# EAGLE design robotic_arm (EAGLE 8.4.1)
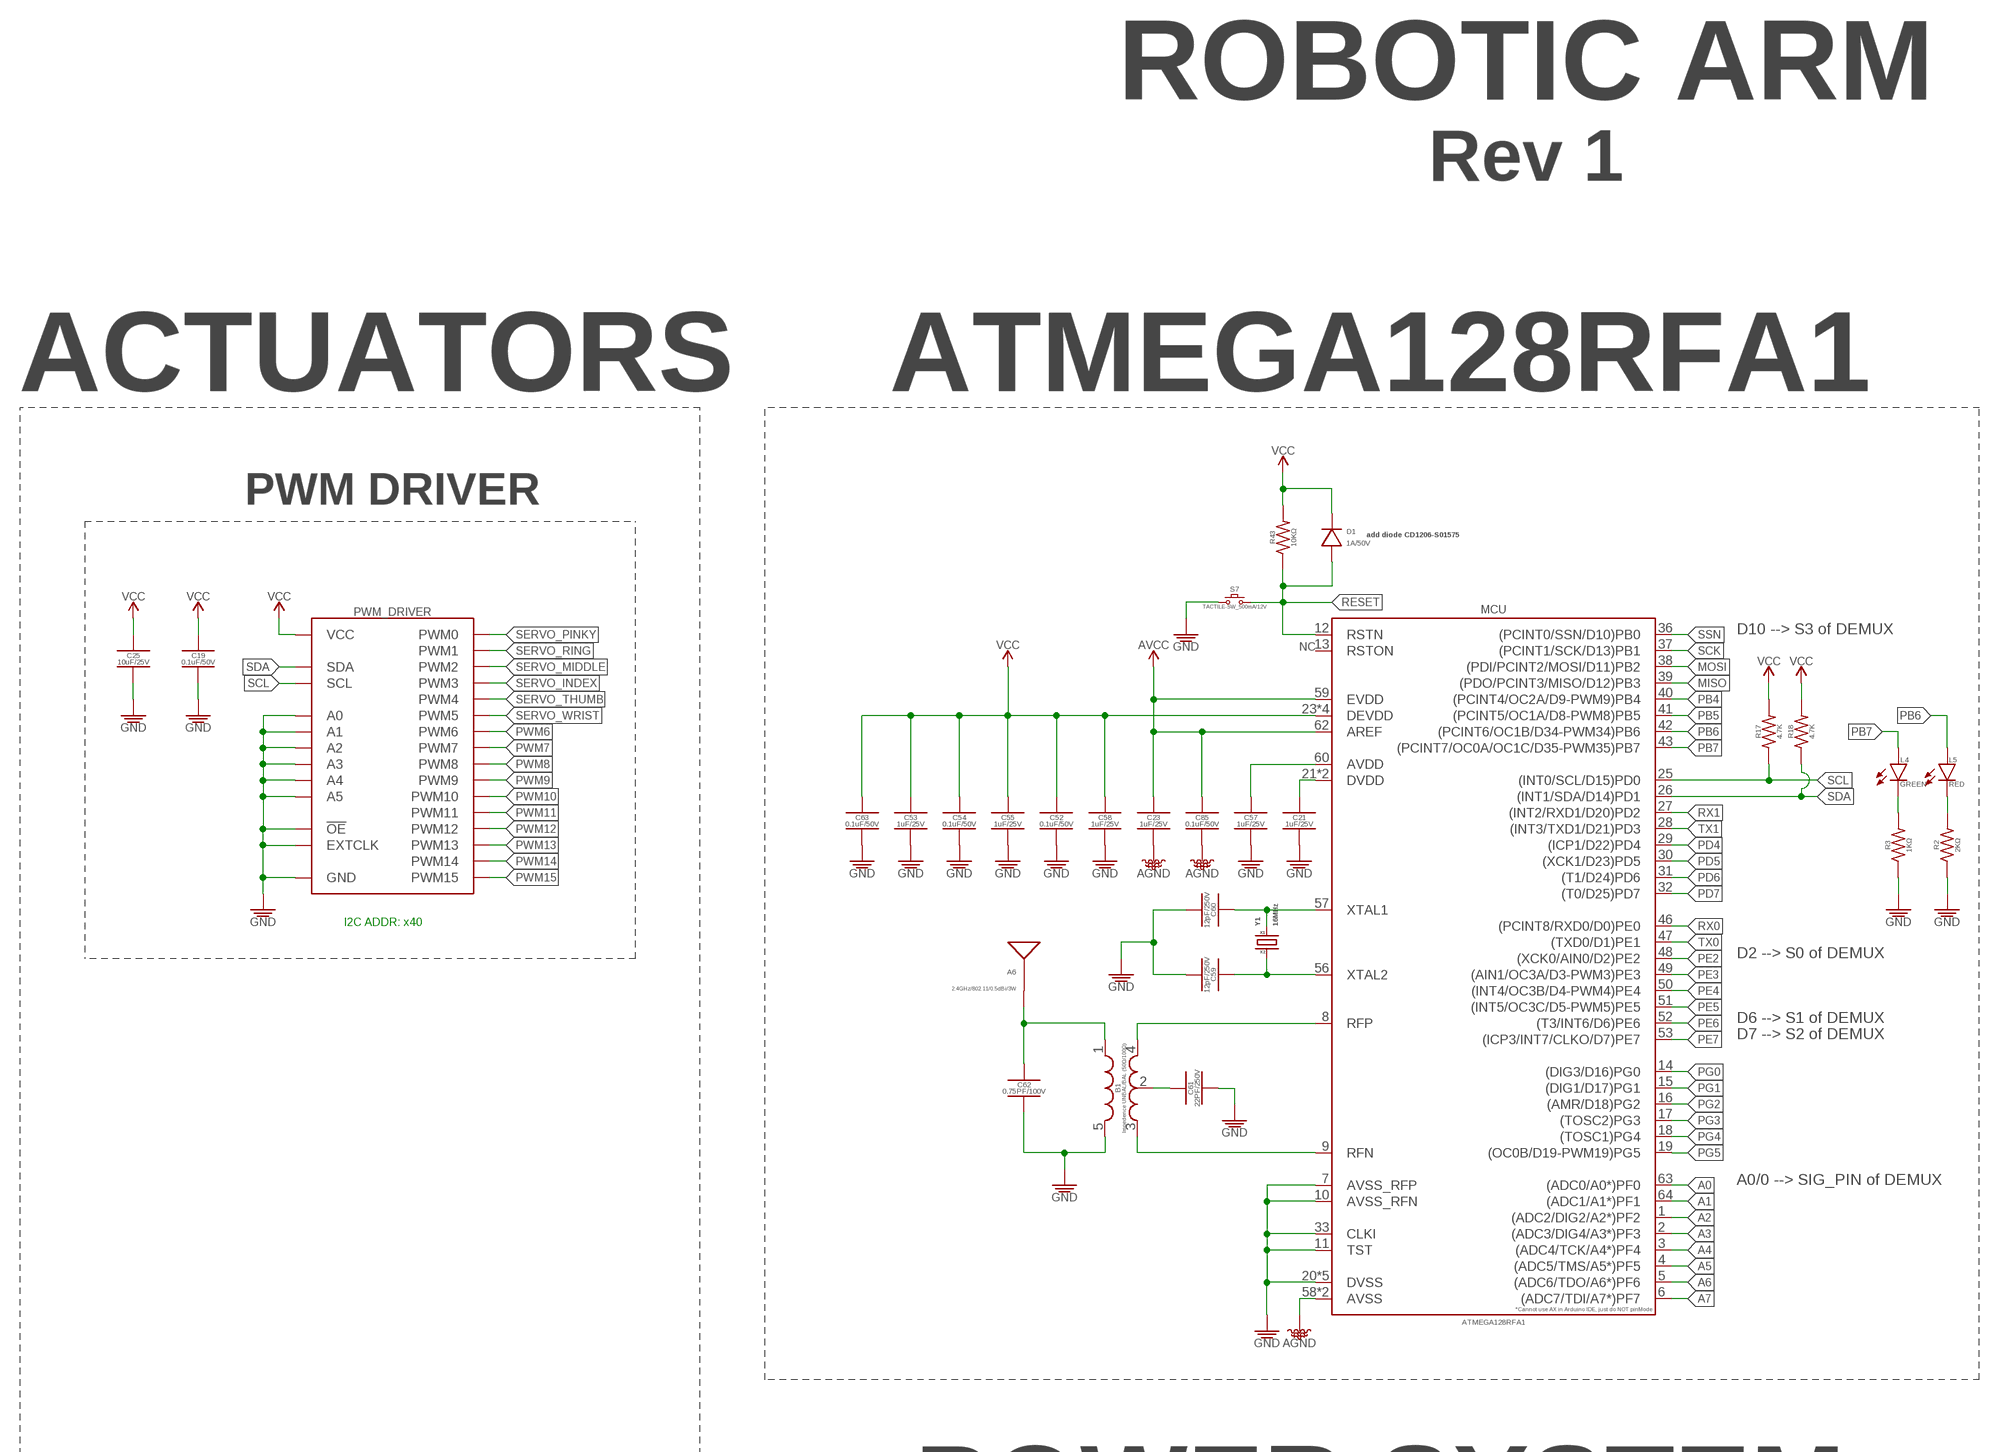
[diagram p0: schematic, sheet 1, part 1 of 3]
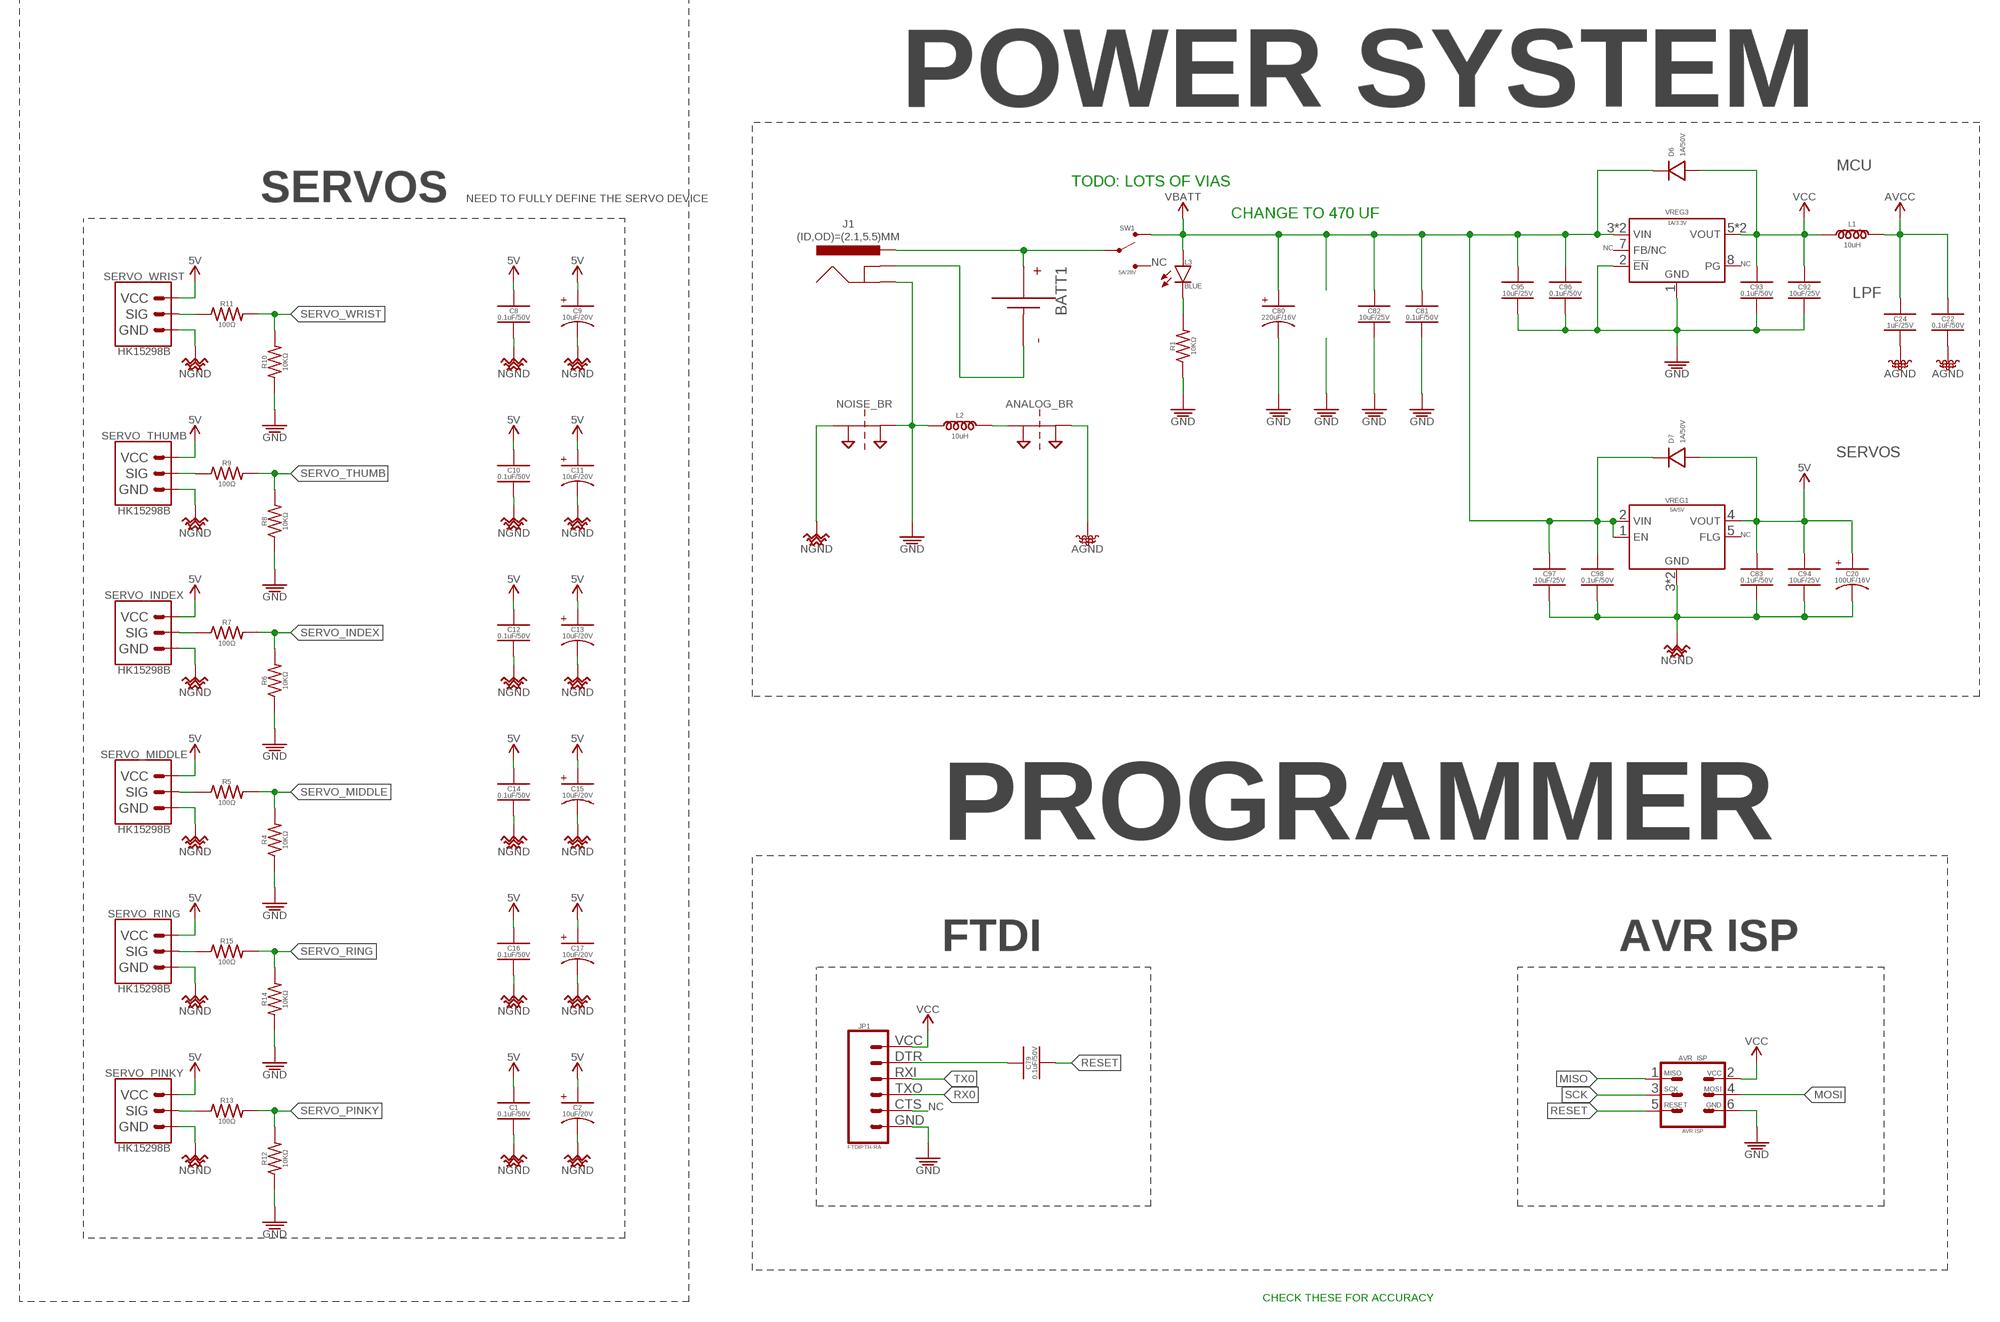
[diagram p1: schematic, sheet 1, part 2 of 3]
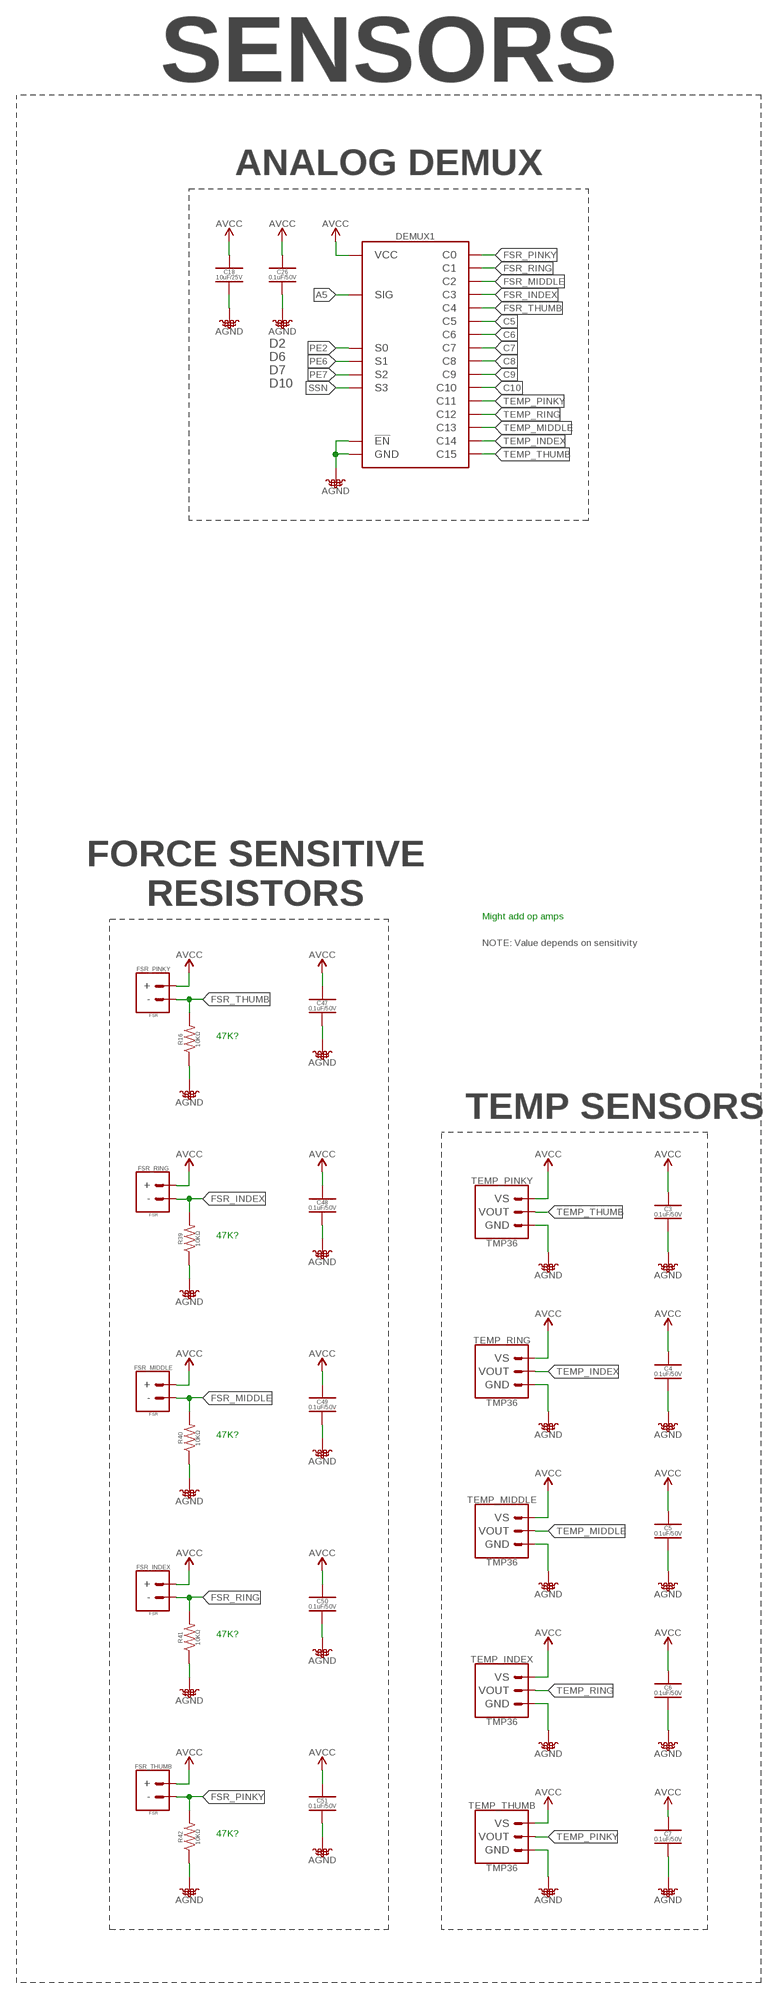
[diagram p2: schematic, sheet 1, part 3 of 3]

## Parts
A6  2.4GHz/802.11/0.5dBi/3W  ANTENNA_SMD-CHIP_2.4GHZ-0.5DBI-3W  [ANTENNA-CHIP5]
ANALOG_BR  2PT_GND_TIE  [2PT_GND_TIE]
AVR_ISP  AVR ISP  AVR_SPI_PRG_6NS  [2X3-NS]
B1  Impedence UNBAL/BAL (50Ω/100Ω)  BALUN_SMD-0805_UNBAL/BAL-50/100  [0805_BALUN]
BATT1  BATTERYPTH_HOLES  [DUAL_PTH_PADS]
C1  0.1uF/50V  0.1UF_SMD-805_50V-10%  [_CER_SMD-805]
C2  10uF/20V  10UF-POLARIZED_SMD-1206_20V-20%  [_TANT_SMD-1206]
C3  0.1uF/50V  0.1UF_SMD-805_50V-10%  [_CER_SMD-805]
C4  0.1uF/50V  0.1UF_SMD-805_50V-10%  [_CER_SMD-805]
C5  0.1uF/50V  0.1UF_SMD-805_50V-10%  [_CER_SMD-805]
C6  0.1uF/50V  0.1UF_SMD-805_50V-10%  [_CER_SMD-805]
C7  0.1uF/50V  0.1UF_SMD-805_50V-10%  [_CER_SMD-805]
C8  0.1uF/50V  0.1UF_SMD-805_50V-10%  [_CER_SMD-805]
C9  10uF/20V  10UF-POLARIZED_SMD-1206_20V-20%  [_TANT_SMD-1206]
C10  0.1uF/50V  0.1UF_SMD-805_50V-10%  [_CER_SMD-805]
C11  10uF/20V  10UF-POLARIZED_SMD-1206_20V-20%  [_TANT_SMD-1206]
C12  0.1uF/50V  0.1UF_SMD-805_50V-10%  [_CER_SMD-805]
C13  10uF/20V  10UF-POLARIZED_SMD-1206_20V-20%  [_TANT_SMD-1206]
C14  0.1uF/50V  0.1UF_SMD-805_50V-10%  [_CER_SMD-805]
C15  10uF/20V  10UF-POLARIZED_SMD-1206_20V-20%  [_TANT_SMD-1206]
C16  0.1uF/50V  0.1UF_SMD-805_50V-10%  [_CER_SMD-805]
C17  10uF/20V  10UF-POLARIZED_SMD-1206_20V-20%  [_TANT_SMD-1206]
C18  10uF/25V  10UF_CER_SMD-805_25V-10%  [_CER_SMD-805]
C19  0.1uF/50V  0.1UF_SMD-805_50V-10%  [_CER_SMD-805]
C20  100UF/16V  100UF-POLARIZED_SMD_16V-20%  [_AE_SMD_L6.6-W6.6]
C21  1uF/25V  1UF_SMD-805_25V-10%  [_CER_SMD-805]
C22  0.1uF/50V  0.1UF_SMD-805_50V-10%  [_CER_SMD-805]
C23  1uF/25V  1UF_SMD-805_25V-10%  [_CER_SMD-805]
C24  1uF/25V  1UF_SMD-805_25V-10%  [_CER_SMD-805]
C25  10uF/25V  10UF_CER_SMD-805_25V-10%  [_CER_SMD-805]
C26  0.1uF/50V  0.1UF_SMD-805_50V-10%  [_CER_SMD-805]
C47  0.1uF/50V  0.1UF_SMD-805_50V-10%  [_CER_SMD-805]
C48  0.1uF/50V  0.1UF_SMD-805_50V-10%  [_CER_SMD-805]
C49  0.1uF/50V  0.1UF_SMD-805_50V-10%  [_CER_SMD-805]
C50  0.1uF/50V  0.1UF_SMD-805_50V-10%  [_CER_SMD-805]
C51  0.1uF/50V  0.1UF_SMD-805_50V-10%  [_CER_SMD-805]
C52  0.1uF/50V  0.1UF_SMD-805_50V-10%  [_CER_SMD-805]
C53  1uF/25V  1UF_SMD-805_25V-10%  [_CER_SMD-805]
C54  0.1uF/50V  0.1UF_SMD-805_50V-10%  [_CER_SMD-805]
C55  1uF/25V  1UF_SMD-805_25V-10%  [_CER_SMD-805]
C57  1uF/25V  1UF_SMD-805_25V-10%  [_CER_SMD-805]
C58  1uF/25V  1UF_SMD-805_25V-10%  [_CER_SMD-805]
C59  12pF/250V  12PF_SMD-805_250V-5%  [_CER_SMD-805]
C60  12pF/250V  12PF_SMD-805_250V-5%  [_CER_SMD-805]
C61  22PF/250V  22PF_SMD-805_250V-5%  [_CER_SMD-805]
C62  0.75PF/100V  0.75PF_SMD-805_100V-33%  [_CER_SMD-805]
C63  0.1uF/50V  0.1UF_SMD-805_50V-10%  [_CER_SMD-805]
C79  0.1uF/50V  0.1UF_SMD-805_50V-10%  [_CER_SMD-805]
C80  220uF/16V  220UF-POLARIZED_SMD_16V-20%  [_AE_SMD_L6.6-W6.6]
C81  0.1uF/50V  0.1UF_SMD-805_50V-10%  [_CER_SMD-805]
C82  10uF/25V  10UF_CER_SMD-805_25V-10%  [_CER_SMD-805]
C83  0.1uF/50V  0.1UF_SMD-805_50V-10%  [_CER_SMD-805]
C85  0.1uF/50V  0.1UF_SMD-805_50V-10%  [_CER_SMD-805]
C92  10uF/25V  10UF_CER_SMD-805_25V-10%  [_CER_SMD-805]
C93  0.1uF/50V  0.1UF_SMD-805_50V-10%  [_CER_SMD-805]
C94  10uF/25V  10UF_CER_SMD-805_25V-10%  [_CER_SMD-805]
C95  10uF/25V  10UF_CER_SMD-805_25V-10%  [_CER_SMD-805]
C96  0.1uF/50V  0.1UF_SMD-805_50V-10%  [_CER_SMD-805]
C97  10uF/25V  10UF_CER_SMD-805_25V-10%  [_CER_SMD-805]
C98  0.1uF/50V  0.1UF_SMD-805_50V-10%  [_CER_SMD-805]
D1  1A/50V  DIODE_GENERAL-PURPOSE_SMD_GP_1A-50V  [SOD123F]
D6  1A/50V  DIODE_GENERAL-PURPOSE_SMD_GP_1A-50V  [SOD123F]
D7  1A/50V  DIODE_GENERAL-PURPOSE_SMD_GP_1A-50V  [SOD123F]
DEMUX1  CH16_MUX-DEMUX  CD74HC4067-SM96_16:1_MUX-DEMUX  [SSOP-24]
FSR_INDEX  FSR  FSR_FORCE-SENSATIVE-RESISTOR_PRESS-SENSOR  [CONNECTOR_FSR]
FSR_MIDDLE  FSR  FSR_FORCE-SENSATIVE-RESISTOR_PRESS-SENSOR  [CONNECTOR_FSR]
FSR_PINKY  FSR  FSR_FORCE-SENSATIVE-RESISTOR_PRESS-SENSOR  [CONNECTOR_FSR]
FSR_RING  FSR  FSR_FORCE-SENSATIVE-RESISTOR_PRESS-SENSOR  [CONNECTOR_FSR]
FSR_THUMB  FSR  FSR_FORCE-SENSATIVE-RESISTOR_PRESS-SENSOR  [CONNECTOR_FSR]
J1  (ID,OD)=(2.1,5.5)MM  POWER_JACK-BARREL_ID2.1MM-OD5.5MM  [POWER_JACK_SLOT_ID2.1MM-OD5.5MM]
JP1  FTDIPTH-RA  [FTDI_BASIC-6PIN-MALE-RA]
L1  10uH  10UH_SMD-805_0.5A-0.65OHM-10%  [_SMD-805]
L2  10uH  10UH_SMD-805_0.5A-0.65OHM-10%  [_SMD-805]
L3  BLUE  LED_SMD-0805_DISCRETE_BLUE  [LED_SMD-805_]
L4  GREEN  LED_SMD-0805_DISCRETE_GREEN  [LED_SMD-805_]
L5  RED  LED_SMD-0805_DISCRETE_RED  [LED_SMD-805_]
MCU  ATMEGA128RFA1  ATMEGA128RFA1_VFQFN-64_EXPOSED-PAD  [VFQFN-64]
NOISE_BR  2PT_GND_TIE  [2PT_GND_TIE]
PWM_DRIVER  PCA9685  PCA9685_16-CH_12-BIT_PWM-DRIVER  [TSSOP-28]
R1  10KΩ  10KΩ_SMD-0805_1/8W-5%  [RESISTOR_SMD-805]
R2  2KΩ  2KΩ_SMD-0805_1/8W-5%  [RESISTOR_SMD-805]
R3  1KΩ  1KΩ_SMD-0805_1/8W-5%  [RESISTOR_SMD-805]
R4  10KΩ  10KΩ_SMD-0805_1/8W-5%  [RESISTOR_SMD-805]
R5  100Ω  100Ω_SMD-0805_1/8W-5%  [RESISTOR_SMD-805]
R6  10KΩ  10KΩ_SMD-0805_1/8W-5%  [RESISTOR_SMD-805]
R7  100Ω  100Ω_SMD-0805_1/8W-5%  [RESISTOR_SMD-805]
R8  10KΩ  10KΩ_SMD-0805_1/8W-5%  [RESISTOR_SMD-805]
R9  100Ω  100Ω_SMD-0805_1/8W-5%  [RESISTOR_SMD-805]
R10  10KΩ  10KΩ_SMD-0805_1/8W-5%  [RESISTOR_SMD-805]
R11  100Ω  100Ω_SMD-0805_1/8W-5%  [RESISTOR_SMD-805]
R12  10KΩ  10KΩ_SMD-0805_1/8W-5%  [RESISTOR_SMD-805]
R13  100Ω  100Ω_SMD-0805_1/8W-5%  [RESISTOR_SMD-805]
R14  10KΩ  10KΩ_SMD-0805_1/8W-5%  [RESISTOR_SMD-805]
R15  100Ω  100Ω_SMD-0805_1/8W-5%  [RESISTOR_SMD-805]
R16  10KΩ  10KΩ_SMD-0805_1/8W-5%  [RESISTOR_SMD-805]
R17  4.7K  4.7KΩ_SMD-0805_1/8W-5%  [RESISTOR_SMD-805]
R18  4.7K  4.7KΩ_SMD-0805_1/8W-5%  [RESISTOR_SMD-805]
R39  10KΩ  10KΩ_SMD-0805_1/8W-5%  [RESISTOR_SMD-805]
R40  10KΩ  10KΩ_SMD-0805_1/8W-5%  [RESISTOR_SMD-805]
R41  10KΩ  10KΩ_SMD-0805_1/8W-5%  [RESISTOR_SMD-805]
R42  10KΩ  10KΩ_SMD-0805_1/8W-5%  [RESISTOR_SMD-805]
R43  10KΩ  10KΩ_SMD-0805_1/8W-5%  [RESISTOR_SMD-805]
S7  TACTILE-SW_500mA/12V  SWITCH_MOMENTARYSPST-SMD-50MA-12V_L5.2-W5.2  [BTN_MOMENTARY_SPST-NO_SMD_12V_50MA_L5.2-W5.2]
SERVO_INDEX  HK15298B  SERVO-HK15298B  [CONNECTOR_SERVO]
SERVO_MIDDLE  HK15298B  SERVO-HK15298B  [CONNECTOR_SERVO]
SERVO_PINKY  HK15298B  SERVO-HK15298B  [CONNECTOR_SERVO]
SERVO_RING  HK15298B  SERVO-HK15298B  [CONNECTOR_SERVO]
SERVO_THUMB  HK15298B  SERVO-HK15298B  [CONNECTOR_SERVO]
SERVO_WRIST  HK15298B  SERVO-HK15298B  [CONNECTOR_SERVO]
SW1  5A/28V  SWITCH_SPDT_VERT_PTH_5A-28V_13L-7W  [SW_TOGGLE_SPDT_5A-28V_13L-7W]
TEMP_INDEX  TMP36  TEMPERATURE-SENSOR_TMP36  [CONNECTOR_TMP36]
TEMP_MIDDLE  TMP36  TEMPERATURE-SENSOR_TMP36  [CONNECTOR_TMP36]
TEMP_PINKY  TMP36  TEMPERATURE-SENSOR_TMP36  [CONNECTOR_TMP36]
TEMP_RING  TMP36  TEMPERATURE-SENSOR_TMP36  [CONNECTOR_TMP36]
TEMP_THUMB  TMP36  TEMPERATURE-SENSOR_TMP36  [CONNECTOR_TMP36]
VREG1  5A/5V  VREG_MIC29501-5.0_LINEAR_ULDO_5A-5VMIC29501-5.0_5A-5V  [TO-263-5]
VREG3  1A/3.3V  VREG_TPS76833_ULDO_FAST-TRANSIENT_1A-3.3VTPS76833QDR_1A-3.3V  [SOIC-8_W3.9MM]
Y1  16MHz  CRYSTAL_ABM3B_16MHZ_18PF  [CRYSTAL-SMD-5X3]

## Nets
5V: C1.1 C2.+(A) C8.1 C9.+(A) C10.1 C11.+(A) C12.1 C13.+(A) C14.1 C15.+(A) C16.1 C17.+(A) C20.A C83.1 C94.1 D7.A SERVO_INDEX.2(VCC) SERVO_MIDDLE.2(VCC) SERVO_PINKY.2(VCC) SERVO_RING.2(VCC) SERVO_THUMB.2(VCC) SERVO_WRIST.2(VCC) VREG1.4(VOUT)
A0: MCU.63((ADC0/A0*)PF0)
A1: MCU.64((ADC1/A1*)PF1)
A2: MCU.1((ADC2/DIG2/A2*)PF2)
A3: MCU.2((ADC3/DIG4/A3*)PF3)
A4: MCU.3((ADC4/TCK/A4*)PF4)
A5: DEMUX1.1(SIG) MCU.4((ADC5/TMS/A5*)PF5)
A6: MCU.5((ADC6/TDO/A6*)PF6)
A7: MCU.6((ADC7/TDI/A7*)PF7)
AGND: ANALOG_BR.P$2 C3.2 C4.2 C5.2 C6.2 C7.2 C18.2 C22.2 C23.2 C24.2 C26.2 C47.2 C48.2 C49.2 C50.2 C51.2 C85.2 DEMUX1.12(GND) DEMUX1.15(!EN) MCU.58(AVSS) MCU.61(AVSS) R16.1 R39.1 R40.1 R41.1 R42.1 TEMP_INDEX.3(GND) TEMP_MIDDLE.3(GND) TEMP_PINKY.3(GND) TEMP_RING.3(GND) TEMP_THUMB.3(GND)
AVCC: C3.1 C4.1 C5.1 C6.1 C7.1 C18.1 C22.1 C23.1 C24.1 C26.1 C47.1 C48.1 C49.1 C50.1 C51.1 C85.1 DEMUX1.24(VCC) FSR_INDEX.+ FSR_MIDDLE.+ FSR_PINKY.+ FSR_RING.+ FSR_THUMB.+ L1.2 MCU.59(EVDD) MCU.62(AREF) TEMP_INDEX.1(VS) TEMP_MIDDLE.1(VS) TEMP_PINKY.1(VS) TEMP_RING.1(VS) TEMP_THUMB.1(VS)
BATT_+: BATT1.+(P) J1.PWR SW1.2
BATT_-: BATT1.-(N) J1.GND@2(GND)
C5: DEMUX1.4(C5)
C6: DEMUX1.3(C6)
C7: DEMUX1.2(C7)
C8: DEMUX1.23(C8)
C9: DEMUX1.22(C9)
C10: DEMUX1.21(C10)
FSR_INDEX: DEMUX1.6(C3) FSR_RING.- R39.2
FSR_MIDDLE: DEMUX1.7(C2) FSR_MIDDLE.- R40.2
FSR_PINKY: DEMUX1.9(C0) FSR_THUMB.- R42.2
FSR_RING: DEMUX1.8(C1) FSR_INDEX.- R41.2
FSR_THUMB: DEMUX1.5(C4) FSR_PINKY.- R16.2
GND: AVR_ISP.6 B1.5(GND) C19.2 C21.2 C25.2 C52.2 C53.2 C54.2 C55.2 C57.2 C58.2 C59.2 C60.2 C61.2 C62.2 C63.2 C80.K C81.2 C82.2 C92.2 C93.2 C95.2 C96.2 J1.GND@1(GND) JP1.GND L2.1 MCU.7(AVSS_RFP) MCU.10(AVSS_RFN) MCU.11(TST) MCU.20(DVSS) MCU.24(DVSS) MCU.33(CLKI) MCU.35(DVSS) MCU.45(DVSS) MCU.55(DVSS) NOISE_BR.P$2 PWM_DRIVER.1(A0) PWM_DRIVER.2(A1) PWM_DRIVER.3(A2) PWM_DRIVER.4(A3) PWM_DRIVER.5(A4) PWM_DRIVER.14(GND) PWM_DRIVER.23(!OE) PWM_DRIVER.24(A5) PWM_DRIVER.25(EXTCLK) R1.1 R2.1 R3.1 R4.1 R6.1 R8.1 R10.1 R12.1 R14.1 S7.1 VREG3.1(GND) VREG3.2(!EN)
MISO: AVR_ISP.1 MCU.39((PDO/PCINT3/MISO/D12)PB3)
MOSI: AVR_ISP.4 MCU.38((PDI/PCINT2/MOSI/D11)PB2)
N$1: R11.1 SERVO_WRIST.1(SIG)
N$2: L3.K R1.2
N$3: L4.K R3.2
N$4: R9.1 SERVO_THUMB.1(SIG)
N$5: L5.K R2.2
N$6: R7.1 SERVO_INDEX.1(SIG)
N$7: R5.1 SERVO_MIDDLE.1(SIG)
N$8: R15.1 SERVO_RING.1(SIG)
N$9: R13.1 SERVO_PINKY.1(SIG)
N$10: C21.1 MCU.21(DVDD) MCU.22(DVDD)
N$11: C57.1 MCU.60(AVDD)
N$30: C60.1 MCU.57(XTAL1) Y1.3
N$32: B1.3(OUT2) MCU.9(RFN)
N$33: B1.4(OUT1) MCU.8(RFP)
N$34: B1.2(GND) C61.1
N$35: C59.1 MCU.56(XTAL2) Y1.1
N$38: ANALOG_BR.P$1 L2.2
N$39: A6.FEED(SIGNAL) B1.1(IN) C62.1
N$41: C79.1 JP1.DTR
N$42: JP1.CTS
NGND: C1.2 C2.-(K) C8.2 C9.-(K) C10.2 C11.-(K) C12.2 C13.-(K) C14.2 C15.-(K) C16.2 C17.-(K) C20.K C83.2 C94.2 C97.2 C98.2 NOISE_BR.P$1 SERVO_INDEX.3(GND) SERVO_MIDDLE.3(GND) SERVO_PINKY.3(GND) SERVO_RING.3(GND) SERVO_THUMB.3(GND) SERVO_WRIST.3(GND) VREG1.3(GND) VREG1.TAB(GND)
PB4: MCU.40((PCINT4/OC2A/D9-PWM9)PB4)
PB5: MCU.41((PCINT5/OC1A/D8-PWM8)PB5)
PB6: L5.A MCU.42((PCINT6/OC1B/D34-PWM34)PB6)
PB7: L4.A MCU.43((PCINT7/OC0A/OC1C/D35-PWM35)PB7)
PD4: MCU.29((ICP1/D22)PD4)
PD5: MCU.30((XCK1/D23)PD5)
PD6: MCU.31((T1/D24)PD6)
PD7: MCU.32((T0/D25)PD7)
PE2: DEMUX1.10(S0) MCU.48((XCK0/AIN0/D2)PE2)
PE3: MCU.49((AIN1/OC3A/D3-PWM3)PE3)
PE4: MCU.50((INT4/OC3B/D4-PWM4)PE4)
PE5: MCU.51((INT5/OC3C/D5-PWM5)PE5)
PE6: DEMUX1.11(S1) MCU.52((T3/INT6/D6)PE6)
PE7: DEMUX1.14(S2) MCU.53((ICP3/INT7/CLKO/D7)PE7)
PG0: MCU.14((DIG3/D16)PG0)
PG1: MCU.15((DIG1/D17)PG1)
PG2: MCU.16((AMR/D18)PG2)
PG3: MCU.17((TOSC2)PG3)
PG4: MCU.18((TOSC1)PG4)
PG5: MCU.19((OC0B/D19-PWM19)PG5)
PWM6: PWM_DRIVER.12(PWM6)
PWM7: PWM_DRIVER.13(PWM7)
PWM8: PWM_DRIVER.15(PWM8)
PWM9: PWM_DRIVER.16(PWM9)
PWM10: PWM_DRIVER.17(PWM10)
PWM11: PWM_DRIVER.18(PWM11)
PWM12: PWM_DRIVER.19(PWM12)
PWM13: PWM_DRIVER.20(PWM13)
PWM14: PWM_DRIVER.21(PWM14)
PWM15: PWM_DRIVER.22(PWM15)
RESET: AVR_ISP.5 C79.2 D1.A MCU.12(RSTN) R43.1 S7.3
RX0: JP1.TXO MCU.46((PCINT8/RXD0/D0)PE0)
RX1: MCU.27((INT2/RXD1/D20)PD2)
SCK: AVR_ISP.3 MCU.37((PCINT1/SCK/D13)PB1)
SCL: MCU.25((INT0/SCL/D15)PD0) PWM_DRIVER.26(SCL) R17.1
SDA: MCU.26((INT1/SDA/D14)PD1) PWM_DRIVER.27(SDA) R18.1
SERVO_INDEX: PWM_DRIVER.9(PWM3) R6.2 R7.2
SERVO_MIDDLE: PWM_DRIVER.8(PWM2) R4.2 R5.2
SERVO_PINKY: PWM_DRIVER.6(PWM0) R12.2 R13.2
SERVO_RING: PWM_DRIVER.7(PWM1) R14.2 R15.2
SERVO_THUMB: PWM_DRIVER.10(PWM4) R8.2 R9.2
SERVO_WRIST: PWM_DRIVER.11(PWM5) R10.2 R11.2
SSN: DEMUX1.13(S3) MCU.36((PCINT0/SSN/D10)PB0)
TEMP_INDEX: DEMUX1.17(C14) TEMP_RING.2(VOUT)
TEMP_MIDDLE: DEMUX1.18(C13) TEMP_MIDDLE.2(VOUT)
TEMP_PINKY: DEMUX1.20(C11) TEMP_THUMB.2(VOUT)
TEMP_RING: DEMUX1.19(C12) TEMP_INDEX.2(VOUT)
TEMP_THUMB: DEMUX1.16(C15) TEMP_PINKY.2(VOUT)
TX0: JP1.RXI MCU.47((TXD0/D1)PE1)
TX1: MCU.28((INT3/TXD1/D21)PD3)
VBATT: C80.A C81.1 C82.1 C95.1 C96.1 C97.1 C98.1 D6.K D7.K L3.A SW1.1 VREG1.1(EN) VREG1.2(VIN) VREG3.3(VIN) VREG3.4(VIN)
VCC: AVR_ISP.2 C19.1 C25.1 C52.1 C53.1 C54.1 C55.1 C58.1 C63.1 C92.1 C93.1 D1.K D6.A JP1.VCC L1.1 MCU.23(DEVDD) MCU.34(DEVDD) MCU.44(DEVDD) MCU.54(DEVDD) PWM_DRIVER.28(VCC) R17.2 R18.2 R43.2 VREG3.5(VOUT) VREG3.6(VOUT)
Unconnected: MCU.13(RSTON) SW1.3 VREG1.5(FLG) VREG3.7(FB/NC) VREG3.8(PG)

## Notes on the sheet
- TRANSMISSION OF TOUCH VR
- ROBOTIC ARM
- Rev 1
- ACTUATORS | ATMEGA128RFA1 | SENSORS
- PWM DRIVER | ANALOG DEMUX
- add diode CD1206-S01575
- D10 --> S3 of DEMUX
- NC
- D2
- D6
- D7
- D10
- I2C ADDR: x40
- D2 --> S0 of DEMUX
- D6 --> S1 of DEMUX
- D7 --> S2 of DEMUX
- A0/0 --> SIG_PIN of DEMUX
- FORCE SENSITIVE
  RESISTORS
- Might add op amps
- NOTE: Value depends on sensitivity
- POWER SYSTEM
- 47K?
- MCU
- TODO: LOTS OF VIAS
- SERVOS | NEED TO FULLY DEFINE THE SERVO DEVICE
- CHANGE TO 470 UF
- TEMP SENSORS
- NC
- NC | NC
- LPF
- 47K?
- SERVOS
- NC
- 47K?
- PROGRAMMER
- 47K?
- FTDI | AVR ISP
- 47K?
- NC
- CHECK THESE FOR ACCURACY

## Library data of the parts
A6 = PiB_radio_frequency:ANTENNA: Chip antenna Single endded antenna. Common with smaller chip antennas. CHIP4 package is the GPS Chip Antenna SKU: GPS-08418. CHIP5 package is 2.4GHz chip antenna SKU: WRL-00144.; CREATOR: Kenmei; DATASHEET: http://www.linxtechnologies.com/resources/data-guides/ant-xxx-chp-x.pdf; DIST: Digikey; DISTLINK: https://www.digikey.com/products/en?keywords=ANT-2.45-CHPCT-ND; DISTPN: ANT-2.45-CHPCT-ND; MFR: Linx Technologies Inc.; MPN: ANT-2.45-CHP-T
ANALOG_BR NOISE_BR = PiB_power_symbols:2PT_GND_TIE
AVR_ISP = PiB_connectors:AVR_SPI_PRG_6: AVR ISP 6 Pin This is the reduced ISP connector for AVR programming. Common on Arduino. This footprint will take up less PCB space and can be used with a 10-pin to 6-pin adapter such as SKU: BOB-08508; DATASHEET: http://portal.fciconnect.com/Comergent//fci/drawing/67996.pdf; DIST: Digikey; DISTLINK: https://www.digikey.com/products/en?keywords=609-3234-ND; DISTPN: 609-3234-ND; MFR: Amphenol FCI; MPN: 67997-206HLF
B1 = PiB_radio_frequency:BALUN: 0805 footprint balun- Ember 351/357; CREATOR: Kenmei; DATASHEET: http://katalog.we-online.de/pbs/datasheet/748421245.pdf; DIST: Digikey; DISTLINK: https://www.digikey.com/products/en?keywords=732-2230-6-ND; DISTPN: 732-2230-6-ND; MFR: Wurth Electronics Inc; MPN: 748421245
BATT1 = PiB:BATTERY: Generic Dual SMD Pad for Bettery Soldering
C1 C3-C8 C10 C12 C14 C16 C19 C22 C26 C47-C52 C54 C63 C79 C81 C83 C85 C93 C96 C98 = PiB_capacitors:0.1UF; CREATOR: MrSwirlyEyes; DATASHEET: http://psearch.en.murata.com/capacitor/product/GRM21BR71H104KA01%23.pdf; DIST: Digikey; DISTLINK: https://www.digikey.com/products/en?keywords=490-1666-1-ND; DISTPN: 490-1666-1-ND; MFR: Murata Electronics North America; MPN: GRM21BR71H104KA01L; TESTED: NO
C2 C9 C11 C13 C15 C17 = PiB_capacitors:10UF-POLARIZED; CREATOR: Kenmei; DATASHEET: http://datasheets.avx.com/TCJ.pdf; DIST: Digikey; DISTLINK: https://www.digikey.com/products/en?keywords=478-9999-1-ND; DISTPN: 478-9999-1-ND; MFR: AVX Corporation; MPN: TCJA106M020R0150
C18 C25 C82 C92 C94 C95 C97 = PiB_capacitors:10UF; CREATOR: MrSwirlyEyes; DATASHEET: http://search.murata.co.jp/Ceramy/image/img/A01X/G101/ENG/GRM21BR61E106KA73-01.pdf; DIST: Digikey; DISTLINK: https://www.digikey.com/product-detail/en/murata-electronics-north-america/GRM21BR61E106KA73K/490-16824-1-ND/7595732; DISTPN: 490-16824-1-ND; MFR: Murata Electronics North America; MPN: GRM21BR61E106KA73K; TESTED: NO
C20 = PiB_capacitors:100UF-POLARIZED; CREATOR: MrSwirlyEyes; DATASHEET: http://industrial.panasonic.com/www-cgi/jvcr13pz.cgi?E+PZ+3+ABA0120+EEEFK1C101P+7+WW; DIST: Digikey; DISTLINK: https://www.digikey.com/products/en?keywords=PCE3783CT-ND; DISTPN: PCE3783CT-ND; MFR: Panasonic Electronic Components; MPN: EEE-FK1C101P; TESTED: NO
C21 C23 C24 C53 C55 C57 C58 = PiB_capacitors:1UF; CREATOR: Kenmei; DATASHEET: http://search.murata.co.jp/Ceramy/image/img/A01X/G101/ENG/GRM216R61E105KA12-01.pdf; DIST: Digikey; DISTLINK: https://www.digikey.com/product-detail/en/murata-electronics-north-america/GRM216R61E105KA12D/490-1700-1-ND/587586; DISTPN: 490-1700-1-ND; MFR: Murata Electronics North America; MPN: GRM216R61E105KA12D; TESTED: NO
C59 C60 = PiB_capacitors:12PF; CREATOR: Kenmei; DATASHEET: http://search.murata.co.jp/Ceramy/image/img/A01X/G101/ENG/GRM21A5C2E120JW01-01.pdf; DIST: Digikey; DISTLINK: https://www.digikey.com/products/en?keywords=490-5531-1-ND; DISTPN: 490-5531-1-ND; MFR: Murata Electronics North America; MPN: GRM21A5C2E120JW01D; TESTED: NO
C61 = PiB_capacitors:22PF; CREATOR: Kenmei; DATASHEET: http://search.murata.co.jp/Ceramy/image/img/A01X/G101/ENG/GRM21A5C2E220JW01-01.pdf; DIST: Digikey; DISTLINK: https://www.digikey.com/product-detail/en/murata-electronics-north-america/GRM21A5C2E220JW01D/490-5534-1-ND/2334930; DISTPN: 490-5534-1-ND; MFR: Murata Electronics North America; MPN: GRM21A5C2E220JW01D; TESTED: NO
C62 = PiB_capacitors:0.75PF; CREATOR: Kenmei; DATASHEET: http://search.murata.co.jp/Ceramy/image/img/A01X/G101/ENG/GQM2195C2AR75CB01-01.pdf; DIST: Digikey; DISTLINK: https://www.digikey.com/product-detail/en/murata-electronics-north-america/GQM2195C2AR75CB01D/490-3585-1-ND/789585; DISTPN: 490-3585-1-ND; MFR: Murata Electronics North America; MPN: GQM2195C2AR75CB01D; TESTED: NO
C80 = PiB_capacitors:220UF-POLARIZED; CREATOR: MrSwirlyEyes; DATASHEET: https://industrial.panasonic.com/cdbs/www-data/pdf/RDE0000/ABA0000C1240.pdf; DIST: Digikey; DISTLINK: https://www.digikey.com/products/en?keywords=P15089CT-ND; DISTPN: P15089CT-ND; MFR: Panasonic Electronic Components; MPN: EEE-FT1C221AP; TESTED: NO
D1 D6 D7 = PiB_discrete_semiconductors:DIODE_GENERAL-PURPOSE; CREATOR: MrSwirlyEyes; DATASHEET: http://www.comchiptech.com/cms/UserFiles/CGRKM4001-HF%20Thru.%20CGRKM4007-HF%20RevG.pdf; DIST: Digikey; DISTLINK: https://www.digikey.com/products/en?keywords=641-1511-1-ND; DISTPN: 641-1511-1-ND; MFR: Comchip Technology; MPN: CGRKM4001-HF; TESTED: NO
DEMUX1 = PiB:CD74HC4067-SM96_16:1_MUX-DEMUX; CREATOR: MrSwirlyEyes; DATASHEET: http://www.ti.com/lit/ds/symlink/cd74hc4067.pdf; DIST: Digikey; DISTLINK: https://www.digikey.com/products/en?keywords=296-9226-1-ND; DISTPN: 296-9226-1-ND; MFR: Texas Instruments; MPN: CD74HC4067SM96; TESTED: NO
FSR_INDEX FSR_MIDDLE FSR_PINKY FSR_RING FSR_THUMB = PiB:FSR_FORCE-SENSATIVE-RESISTOR_PRESS-SENSOR; CREATOR: MrSwirlyEyes; DATASHEET: http://www.interlinkelectronics.com/datasheets/Datasheet_FSR.pdf; DIST: Digikey; DISTLINK: https://www.digikey.com/products/en?keywords=1027-1014-ND; DISTPN: 1027-1014-ND; MFR: Interlink Electronics; MPN: 34-00004; QUERY: https://www.digikey.com/products/en/sensors-transducers/force-sensors/531?k=force+sensitive+resistor&k=&pkeyword=force+sensitive+resistor&pv1260=27&pv1260=26&pv1260=42&pv1260=20&pv1260=29&FV=ffe00213%2C884001a&mnonly=0&ColumnSort=0&page=1&quantity=0&ptm=0&fid=0&pageSize=250; TESTED: NO
J1 = PiB_connectors:POWER_JACK-BARREL_ID2.1MM-OD5.5MM; CREATOR: MrSwirlyEyes; DATASHEET: http://www.memoryprotectiondevices.com/datasheets/EJ508A-datasheet.pdf; DIST: Digikey; DISTLINK: https://www.digikey.com/products/en?keywords=EJ508A-ND; DISTPN: EJ508A-ND; MFR: MPD (Memory Protection Devices); MPN: EJ508A; TESTED: NO
JP1 = PiB_connectors:FTDI: FTDI Basic header with labels; DATASHEET: http://portal.fciconnect.com/Comergent//fci/drawing/68015.pdf; DIST: Digikey; DISTLINK: https://www.digikey.com/products/en?keywords=609-3327-ND; DISTPN: 609-3327-ND; MFR: Amphenol FCI; MPN: 68016-406HLF; PRICE: 0.33
L1 L2 = PiB_inductors:10UH; CREATOR: MrSwirlyEyes; DATASHEET: http://ds.yuden.co.jp/TYCOMPAS/ut/detail.do?productNo=CB2012T100KR&fileName=CB2012T100KR_SS&mode=specSheetDownload; DIST: Digikey; DISTLINK: https://www.digikey.com/products/en?keywords=587-2452-1-ND; DISTPN: 587-2452-1-ND; MFR: Taiyo Yuden; MPN: CB2012T100KR
L3 = PiB_leds:LED; CREATOR: MrSwirlyEyes; DATASHEET: http://optoelectronics.liteon.com/upload/download/DS-22-99-0226/LTST-C170TBKT.pdf; DIST: Digikey; DISTLINK: https://www.digikey.com/products/en?keywords=160-1579-1-ND; DISTPN: 160-1579-1-ND; MFR: Lite-On Inc.; MPN: LTST-C170TBKT; TESTED: NO
L4 = PiB_leds:LED; CREATOR: MrSwirlyEyes; DATASHEET: http://optoelectronics.liteon.com/upload/download/DS22-2000-073/LTST-C170KGKT.pdf; DIST: Digikey; DISTLINK: https://www.digikey.com/products/en?keywords=160-1414-1-ND; DISTPN: 160-1414-1-ND; MFR: Lite-On Inc.; MPN: LTST-C170KGKT; TESTED: NO
L5 = PiB_leds:LED; CREATOR: MrSwirlyEyes; DATASHEET: http://optoelectronics.liteon.com/upload/download/DS-22-99-0150/LTST-C170KRKT.pdf; DIST: Digikey; DISTLINK: https://www.digikey.com/products/en?keywords=160-1415-1-ND; DISTPN: 160-1415-1-ND; MFR: Lite-On Inc.; MPN: LTST-C170KRKT; TESTED: NO
MCU = PiB_ic_microcontrollers:ATMEGA128RFA1: ATmega128RFA1 8-bit AVR Microcontroller with Low Power 2.4GHz Transceiver for ZigBee and IEEE 802.15.4; CREATOR: Kenmei; DATASHEET: http://www.atmel.com/Images/Atmel-8266-MCU_Wireless-ATmega128RFA1_Datasheet.pdf; DIST: Digikey; DISTLINK: https://www.digikey.com/products/en?mpart=ATMEGA128RFA1-ZU; DISTPN: ATMEGA128RFA1-ZU-ND; MFR: Atmel; MPN: ATMEGA128RFA1-ZU; TESTED: YES
PWM_DRIVER = PiB:PCA9685_16-CH_12-BIT_PWM-DRIVER; CREATOR: MrSwirlyEyes; DATASHEET: http://www.nxp.com/docs/en/data-sheet/PCA9685.pdf; DIST: Digikey; DISTLINK: https://www.digikey.com/products/en?keywords=568-11925-1-ND; DISTPN: 568-11925-1-ND; MFR: NXP USA Inc.; MPN: PCA9685PW,118
R1 R4 R6 R8 R10 R12 R14 R16 R39-R43 = PiB_resistors:10KΩ; CREATOR: Kenmei; DATASHEET: http://www.yageo.com/documents/recent/PYu-RC_Group_51_RoHS_L_7.pdf; DIST: Digikey; DISTLINK: https://www.digikey.com/products/en?keywords=311-10KARCT-ND; DISTPN: 311-10KARCT-ND; MFR: Yageo; MPN: RC0805JR-0710KL; TESTED: YES
R2 = PiB_resistors:2KΩ; CREATOR: MrSwirlyEyes; DATASHEET: http://www.yageo.com/documents/recent/PYu-RC_Group_51_RoHS_L_7.pdf; DIST: Digikey; DISTLINK: https://www.digikey.com/products/en?keywords=311-2.0KARCT-ND; DISTPN: 311-2.0KARCT-ND; MFR: Yageo; MPN: RC0805JR-072KL
R3 = PiB_resistors:1KΩ; CREATOR: Kenmei; DATASHEET: http://www.yageo.com/documents/recent/PYu-RC_Group_51_RoHS_L_7.pdf; DIST: Digikey; DISTLINK: https://www.digikey.com/product-detail/en/yageo/RC0805JR-071KL/311-1.0KARCT-ND/731165; DISTPN: 311-1.0KARCT-ND; MFR: Yageo; MPN: RC0805JR-071KL; TESTED: NO
R5 R7 R9 R11 R13 R15 = PiB_resistors:100Ω; CREATOR: Kenmei; DATASHEET: http://www.yageo.com/documents/recent/PYu-RC_Group_51_RoHS_L_7.pdf; DIST: Digikey; DISTLINK: https://www.digikey.com/products/en?keywords=311-100ARCT-ND; DISTPN: 311-100ARCT-ND; MFR: Yageo; MPN: RC0805JR-07100RL; TESTED: YES
R17 R18 = PiB_resistors:4.7KΩ; CREATOR: MrSwirlyEyes; DATASHEET: http://www.yageo.com/documents/recent/PYu-RC_Group_51_RoHS_L_7.pdf; DIST: Digikey; DISTLINK: https://www.digikey.com/products/en?keywords=311-4.7KARCT-ND; DISTPN: 311-4.7KARCT-ND; MFR: Yageo; MPN: RC0805JR-074K7L
S7 = PiB_switches:SWITCH_MOMENTARY; CREATOR: MrSwirlyEyes; DATASHEET: https://media.digikey.com/pdf/Data%20Sheets/C&K/RS-187R05-DS%20MT_RT.pdf; DIST: Digikey; DISTLINK: https://www.digikey.com/products/en?keywords=CKN10361CT-ND; DISTPN: CKN10361CT-ND; MFR: C&K; MPN: RS-187R05A2-DS MT RT; TESTED: NO
SERVO_INDEX SERVO_MIDDLE SERVO_PINKY SERVO_RING SERVO_THUMB SERVO_WRIST = PiB:SERVO; CREATOR: MrSwirlyEyes; DIST: HobbyKing; DISTLINK: https://hobbyking.com/en_us/hobbykingtm-coreless-digital-hv-mg-bb-servo-20kg-0-16sec-66g.html?___store=en_us; DISTPN: HK15298B; TESTED: NO
SW1 = PiB_switches:SWITCH_SPDT; CREATOR: MrSwirlyEyes; DATASHEET: https://www.e-switch.com/system/asset/product_line/data_sheet/129/100.pdf; DIST: Digikey; DISTLINK: https://www.digikey.com/products/en?keywords=%09EG2355-ND; DISTPN: EG2355-ND; MFR: E-Switch; MPN: 100SP1T1B4M2QE; TESTED: NO
TEMP_INDEX TEMP_MIDDLE TEMP_PINKY TEMP_RING TEMP_THUMB = PiB:TEMPERATURE-SENSOR_TMP36; CREATOR: MrSwirlyEyes; DATASHEET: http://www.analog.com/media/en/technical-documentation/data-sheets/TMP35_36_37.pdf; DIST: Digikey; DISTLINK: https://www.digikey.com/products/en?keywords=TMP36GT9Z-ND; DISTPN: TMP36GT9Z-ND; MFR: Analog Devices Inc.; MPN: TMP36GT9Z; TESTED: NO
VREG1 = PiB_ic_power:VREG_MIC29501-5.0_LINEAR_ULDO_5A-5V; CREATOR: MrSwirlyEyes; DATASHEET: http://ww1.microchip.com/downloads/en/DeviceDoc/20005685A.pdf; DIST: Digikey; DISTLINK: https://www.digikey.com/products/en?keywords=576-2240-ND; DISTPN: 576-2240-ND; MFR: Microchip Technology; MPN: MIC29501-5.0WU
VREG3 = PiB_ic_power:VREG_TPS76833_ULDO_FAST-TRANSIENT_1A-3.3V; CREATOR: MrSwirlyEyes; DATASHEET: http://www.ti.com/lit/ds/symlink/tps768.pdf; DIST: Digikey; DISTLINK: https://www.digikey.com/products/en?keywords=296-46395-1-ND; DISTPN: 296-46395-1-ND; MFR: Texas Instruments; MPN: TPS76833QDR
Y1 = PiB:CRYSTAL: Various standard crystals. Proven footprints.; DATASHEET: http://www.abracon.com/Resonators/abm3b.pdf; DIST: Digikey; DISTLINK: https://www.digikey.com/products/en?keywords=535-9122-1-ND; DISTPN: 535-9122-1-ND; MFR: Abracon LLC; MPN: ABM3B-16.000MHZ-B2-T

## Board
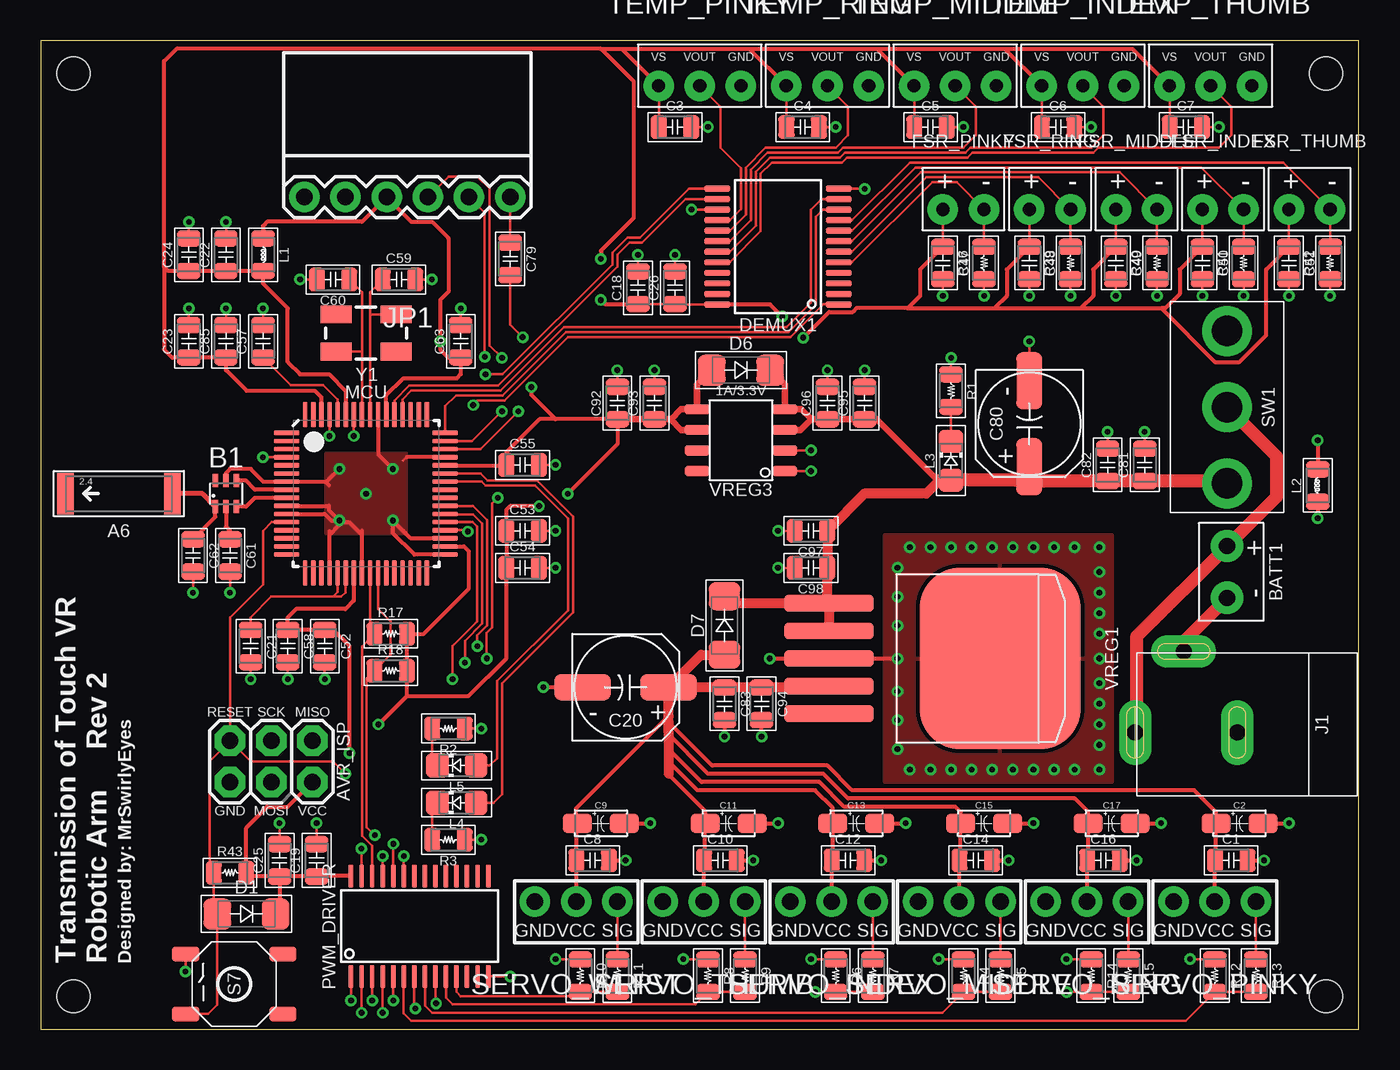
[diagram p3: board, top side]
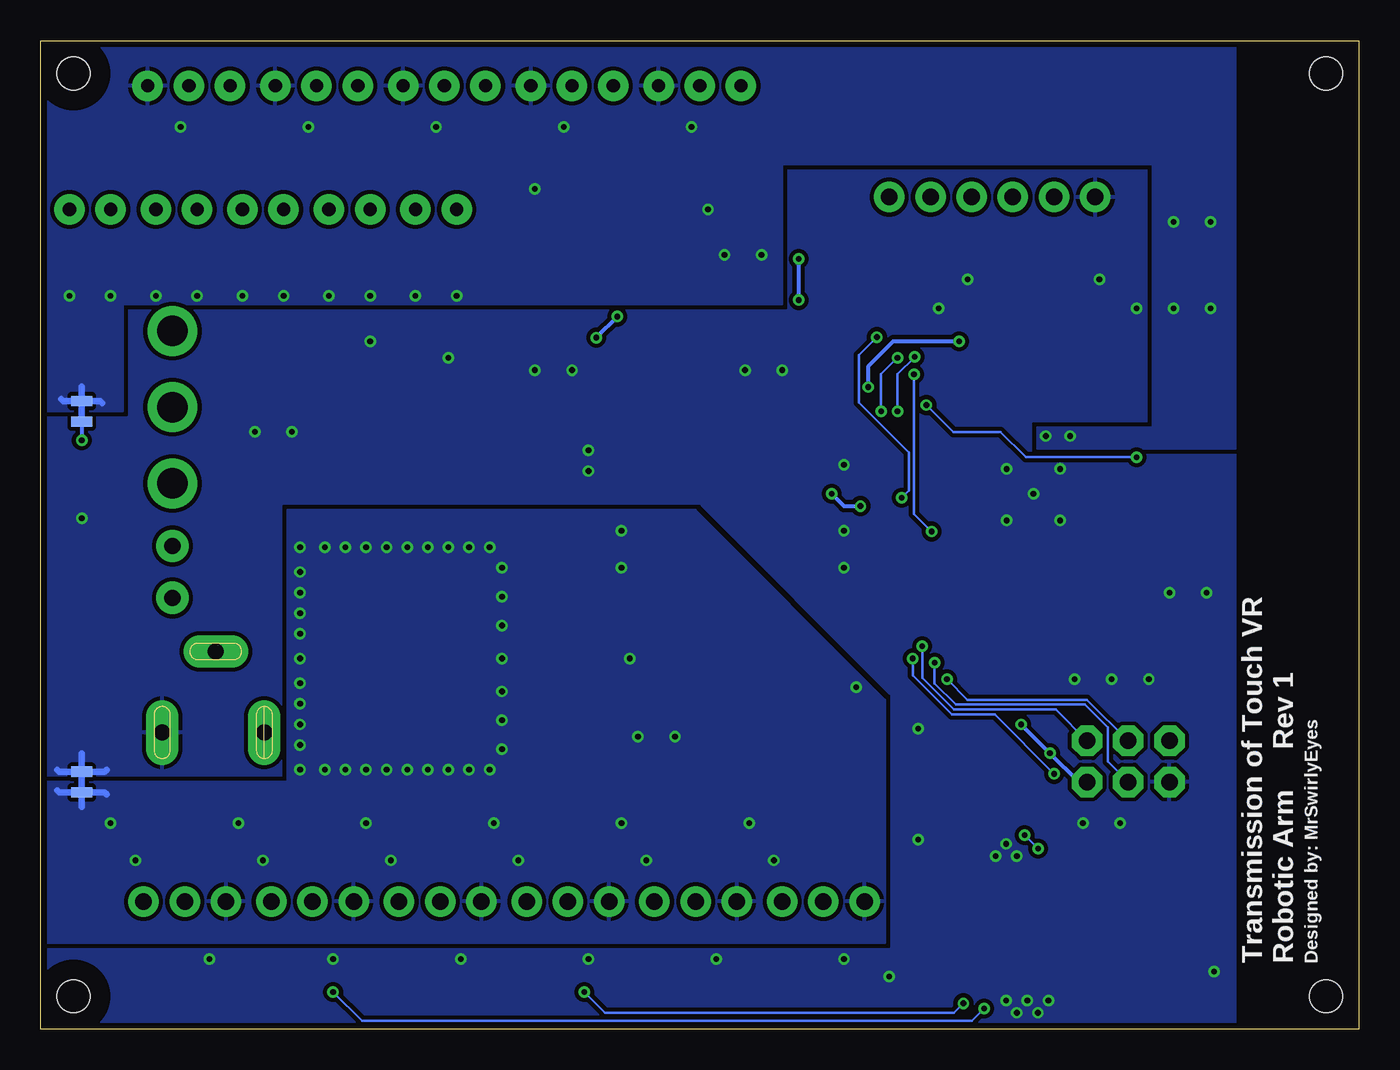
[diagram p4: board, bottom side, seen from below]

Size 81.28 x 60.96 mm. Coordinates in mm from the lower left corner, seen from the top.
Outline: 0,0 81.28,0 81.28,60.96 0,60.96 0,0
Copper layers (1*16): Top 0.0356mm / dielectric 1.5011mm / Bottom 0.0356mm
Design rules "oshpark-2layer": minimum track width 6mil, minimum drill 13mil, track to track 6mil, track to pad 6mil, pad to pad 6mil, via to via 6mil, smd to smd 6mil, copper to edge 15mil, drill to drill 6mil, minimum pad ring 7mil, minimum via ring 7mil, stop-mask expansion 2.5mil, vias tented up to drill 0mil, thermal gap 10mil
Holes 2 mm at 79.25,2.03 2.03,2.03 79.25,58.93 2.03,58.93
tRestrict: area 0,0 to 4,4; area 77.2,0 to 81.2,4; area 77.2,56.9 to 81.2,60.9; area 0,56.9 to 4,60.9; area 14.4,27.4 to 16,29; area 24.1,28.7 to 24.9,29; area 16.3,40.9 to 23.9,48.3
bRestrict: area 77.2,0 to 81.2,4; area 0,0 to 4,4; area 77.2,56.9 to 81.2,60.9; area 0,56.9 to 4,60.9
vRestrict: area 16.1,29.1 to 24,37

### Footprints (pad centres in the part's own frame; a part is rotated, then mirrored left to right if it is on the bottom)
ANTENNA-CHIP5 = smd 1.016 x 2.54: FEED -3.302,0; NC 3.302,0
2PT_GND_TIE = smd 0.635 x 1.27: P$1 -0.635,0; P$2 0.635,0
2X3-NS = drill 1.016 pad 1.88 octagon: 1 -2.54,-1.27; 2 -2.54,1.27; 3 0,-1.27; 4 0,1.27; 5 2.54,-1.27; 6 2.54,1.27
0805_BALUN = smd 0.35 x 0.8: 1 -0.65,-0.8; 2 0,-0.8; 3 0.65,-0.8; 4 0.65,0.8; 5 0,0.8; 6 -0.65,0.8
DUAL_PTH_PADS = drill 1 pad 2: + -1.6,0; - 1.6,0
_CER_SMD-805 = smd 1 x 1.45: 1 -1,0; 2 1,0
_TANT_SMD-1206 = smd 1.8 x 1.2: + -1.45,0; - 1.45,0
_AE_SMD_L6.6-W6.6 = smd 3.5 x 1.6: A -2.65,0; K 2.65,0
SOD123F = smd 1.7 x 1.9: A -1.8,0; K 1.8,0
SSOP-24 = smd 1.6 x 0.35: 1 -3.75,3.575; 2 -3.75,2.925; 3 -3.75,2.275; 4 -3.75,1.625; 5 -3.75,0.975; 6 -3.75,0.325; 7 -3.75,-0.325; 8 -3.75,-0.975; 9 -3.75,-1.625; 10 -3.75,-2.275; 11 -3.75,-2.925; 12 -3.75,-3.575; 13 3.75,-3.575; 14 3.75,-2.925; 15 3.75,-2.275; 16 3.75,-1.625; 17 3.75,-0.975; 18 3.75,-0.325; 19 3.75,0.325; 20 3.75,0.975; 21 3.75,1.625; 22 3.75,2.275; 23 3.75,2.925; 24 3.75,3.575
CONNECTOR_FSR = drill 0.813 pad 1.88: + -1.27,-1.27; - 1.27,-1.27
POWER_JACK_SLOT_ID2.1MM-OD5.5MM = drill 1 pad 2 long: GND@1 -0.5,-0.12; GND@2 4.5,3.18; PWR -0.5,6.18
FTDI_BASIC-6PIN-MALE-RA = drill 1.016 pad 1.88: CTS 10.16,0; DTR 0,0; GND 12.7,0; RXI 2.54,0; TXO 5.08,0; VCC 7.62,0
_SMD-805 = smd 1 x 1.45: 1 -1,0; 2 1,0
LED_SMD-805_ = smd 1.4 x 1.5: A -1.2,0; K 1.2,0
VFQFN-64 = smd 1.562 x 0.28: 1 -4.881,3.75; 2 -4.881,3.25; 3 -4.881,2.75; 4 -4.881,2.25; 5 -4.881,1.75; 6 -4.881,1.25; 7 -4.881,0.75; 8 -4.881,0.25; 9 -4.881,-0.25; 10 -4.881,-0.75; 11 -4.881,-1.25; 12 -4.881,-1.75; 13 -4.881,-2.25; 14 -4.881,-2.75; 15 -4.881,-3.25; 16 -4.881,-3.75; 33 4.881,-3.75; 34 4.881,-3.25; 35 4.881,-2.75; 36 4.881,-2.25; 37 4.881,-1.75; 38 4.881,-1.25; 39 4.881,-0.75; 40 4.881,-0.25; 41 4.881,0.25; 42 4.881,0.75; 43 4.881,1.25; 44 4.881,1.75; 45 4.881,2.25; 46 4.881,2.75; 47 4.881,3.25; 48 4.881,3.75 | smd 0.28 x 1.562: 17 -3.75,-4.881; 18 -3.25,-4.881; 19 -2.75,-4.881; 20 -2.25,-4.881; 21 -1.75,-4.881; 22 -1.25,-4.881; 23 -0.75,-4.881; 24 -0.25,-4.881; 25 0.25,-4.881; 26 0.75,-4.881; 27 1.25,-4.881; 28 1.75,-4.881; 29 2.25,-4.881; 30 2.75,-4.881; 31 3.25,-4.881; 32 3.75,-4.881; 49 3.75,4.881; 50 3.25,4.881; 51 2.75,4.881; 52 2.25,4.881; 53 1.75,4.881; 54 1.25,4.881; 55 0.75,4.881; 56 0.25,4.881; 57 -0.25,4.881; 58 -0.75,4.881; 59 -1.25,4.881; 60 -1.75,4.881; 61 -2.25,4.881; 62 -2.75,4.881; 63 -3.25,4.881; 64 -3.75,4.881
TSSOP-28 = smd 1.4 x 0.3: 1 -3.1,4.225; 2 -3.1,3.575; 3 -3.1,2.925; 4 -3.1,2.275; 5 -3.1,1.625; 6 -3.1,0.975; 7 -3.1,0.325; 8 -3.1,-0.325; 9 -3.1,-0.975; 10 -3.1,-1.625; 11 -3.1,-2.275; 12 -3.1,-2.925; 13 -3.1,-3.575; 14 -3.1,-4.225; 15 3.1,-4.225; 16 3.1,-3.575; 17 3.1,-2.925; 18 3.1,-2.275; 19 3.1,-1.625; 20 3.1,-0.975; 21 3.1,-0.325; 22 3.1,0.325; 23 3.1,0.975; 24 3.1,1.625; 25 3.1,2.275; 26 3.1,2.925; 27 3.1,3.575; 28 3.1,4.225
RESISTOR_SMD-805 = smd 1 x 1.45: 1 -1,0; 2 1,0
BTN_MOMENTARY_SPST-NO_SMD_12V_50MA_L5.2-W5.2 = smd 1.7 x 0.95: 1 -3,1.85; 2 3,1.85; 3 -3,-1.85; 4 3,-1.85
CONNECTOR_SERVO = drill 1.016 pad 1.88: 1 -2.54,-1.27; 2 0,-1.27; 3 2.54,-1.27
SW_TOGGLE_SPDT_5A-28V_13L-7W = drill 1.875 pad 3.075: 1 0,4.7; 2 0,0; 3 0,-4.7
CONNECTOR_TMP36 = drill 0.813 pad 1.88: 1 -2.54,-1.27; 2 0,-1.27; 3 2.54,-1.27
TO-263-5 = smd 1.02 x 5.5: 1 -3.4,-8.545; 2 -1.7,-8.545; 3 0,-8.545; 4 1.7,-8.545; 5 3.4,-8.545 | smd 11.18 x 9.91: TAB 0,2
SOIC-8_W3.9MM = smd 1.55 x 0.6: 1 -2.7,1.905; 2 -2.7,0.635; 3 -2.7,-0.635; 4 -2.7,-1.905; 5 2.7,-1.905; 6 2.7,-0.635; 7 2.7,0.635; 8 2.7,1.905
CRYSTAL-SMD-5X3 = smd 1.9 x 1.1: 1 -1.85,-1.15; 2 1.85,-1.15; 3 1.85,1.15; 4 -1.85,1.15

### Placement (x,y rotation side)
A6  4.83,33.02 180 top
ANALOG_BR  78.74,38.1 90 bottom
AVR_ISP  14.22,16.51 180 top
B1  11.43,33.02 0 top
BATT1  73.15,28.19 270 top
C1  73.41,10.41 0 top
C2  73.91,12.7 0 top
C3  39.12,55.63 0 top
C4  46.99,55.63 0 top
C5  54.86,55.63 0 top
C6  62.74,55.63 0 top
C7  70.61,55.63 0 top
C8  34.04,10.41 0 top
C9  34.54,12.7 0 top
C10  41.91,10.41 0 top
C11  42.42,12.7 0 top
C12  49.78,10.41 0 top
C13  50.29,12.7 0 top
C14  57.66,10.41 0 top
C15  58.17,12.7 0 top
C16  65.53,10.41 0 top
C17  66.04,12.7 0 top
C18  36.83,45.72 90 top
C19  17.02,10.41 90 top
C20  36.07,21.08 180 top
C21  12.95,23.62 270 top
C22  11.43,47.75 90 top
C23  9.14,42.42 90 top
C24  9.14,47.75 90 top
C25  14.73,10.41 90 top
C26  39.12,45.72 90 top
C47  55.63,47.24 270 top
C48  60.96,47.24 270 top
C49  66.29,47.24 270 top
C50  71.63,47.24 270 top
C51  76.96,47.24 270 top
C52  17.53,23.62 270 top
C53  29.72,30.73 0 top
C54  29.72,28.45 0 top
C55  29.72,34.8 0 top
C57  13.72,42.42 90 top
C58  15.24,23.62 270 top
C59  22.1,46.23 0 top
C60  18.03,46.23 180 top
C61  11.68,29.21 270 top
C62  9.4,29.21 270 top
C63  25.91,42.42 90 top
C79  28.96,47.5 270 top
C80  60.96,37.34 90 top
C81  68.07,34.8 90 top
C82  65.79,34.8 90 top
C83  42.16,20.07 270 top
C85  11.43,42.42 90 top
C92  35.56,38.61 90 top
C93  37.85,38.61 90 top
C94  44.45,20.07 270 top
C95  50.8,38.61 90 top
C96  48.51,38.61 90 top
C97  47.5,30.73 180 top
C98  47.5,28.45 180 top
D1  12.7,7.11 0 top
D6  43.18,40.64 0 top
D7  42.16,24.89 90 top
DEMUX1  45.47,48.26 180 top
FSR_INDEX  72.9,51.82 0 top
FSR_MIDDLE  67.56,51.82 0 top
FSR_PINKY  56.9,51.82 0 top
FSR_RING  62.23,51.82 0 top
FSR_THUMB  78.23,51.82 0 top
J1  73.66,18.8 90 top
JP1  28.96,51.31 180 top
L1  13.72,47.75 270 top
L2  78.74,33.53 90 top
L3  56.13,35.05 90 top
L4  25.65,13.97 180 top
L5  25.65,16.26 180 top
MCU  20.07,33.02 0 top
NOISE_BR  78.74,15.24 90 bottom
PWM_DRIVER  23.37,6.35 90 top
R1  56.13,39.37 270 top
R2  25.15,18.54 180 top
R3  25.15,11.68 180 top
R4  56.9,3.3 270 top
R5  59.18,3.3 270 top
R6  49.02,3.3 270 top
R7  51.31,3.3 270 top
R8  41.15,3.3 270 top
R9  43.43,3.3 270 top
R10  33.27,3.3 270 top
R11  35.56,3.3 270 top
R12  72.39,3.3 270 top
R13  74.93,3.3 270 top
R14  64.77,3.3 270 top
R15  67.06,3.3 270 top
R16  58.17,47.24 90 top
R17  21.59,24.38 0 top
R18  21.59,22.1 0 top
R39  63.5,47.24 90 top
R40  68.83,47.24 90 top
R41  74.17,47.24 90 top
R42  79.5,47.24 90 top
R43  11.68,9.65 0 top
S7  11.94,2.79 0 top
SERVO_INDEX  48.77,6.6 180 top
SERVO_MIDDLE  56.64,6.6 180 top
SERVO_PINKY  72.39,6.6 180 top
SERVO_RING  64.52,6.6 180 top
SERVO_THUMB  40.89,6.6 180 top
SERVO_WRIST  33.02,6.6 180 top
SW1  73.15,38.35 180 top
TEMP_INDEX  64.26,59.44 0 top
TEMP_MIDDLE  56.39,59.44 0 top
TEMP_PINKY  40.64,59.44 0 top
TEMP_RING  48.51,59.44 0 top
TEMP_THUMB  72.14,59.44 0 top
VREG1  57.15,22.86 270 top
VREG3  43.18,36.32 180 top
Y1  20.07,42.93 180 top

### Tracks (layer width: path | path; a pad name or v marks a point on that pad's centre or on a via)
5V
  Top 0.152: 48.51,21.07 VREG1.4 | 38.73,21.07 C20.A
  Top 0.254: SERVO_WRIST.2 33.04,7.89 C8.1 33.04,12.64 C9.+ 33.02,12.77 33.02,13.61 38.72,19.3 | SERVO_THUMB.2 40.89,10.4 C10.1 40.97,10.47 C11.+ 40.97,13.46 38.72,15.71 38.72,15.75 | SERVO_INDEX.2 48.78,7.89 C12.1 48.84,10.47 C13.+ 48.84,13.64 47.75,14.73 40.5,14.73 38.72,16.51 | SERVO_MIDDLE.2 56.66,7.89 C14.1 56.72,10.47 C15.+ 56.72,13.39 56.39,13.72 49.53,13.72 48.01,15.24 40.75,15.24 38.72,17.27 | SERVO_RING.2 64.53,7.89 C16.1 64.59,10.47 C17.+ 64.59,13.39 63.75,14.22 49.78,14.22 48.26,15.75 41.15,15.75 38.61,18.29 38.72,18.29 | SERVO_PINKY.2 72.41,7.89 C1.1 72.46,10.47 C2.+ 72.46,13.39 71.12,14.73 50.04,14.73 48.51,16.26 41.4,16.26 38.72,18.94
  Top 0.61: 48.51,21.07 C94.1 C83.1 38.73,21.07 | D7.A 40.73,23.09 C20.A 38.72,19.3 38.72,18.94 38.72,18.29 38.72,17.27 38.72,16.51 38.72,15.75
A5  (via drill 0.35)
  Top 0.152: DEMUX1.1 49.2,44.7 48.26,44.7 46.23,42.67 32.51,42.67 28.6,38.76 26.95,38.76 v26.67,38.48 | MCU.4 v13.72,35.27
  Bottom 0.152: 15.84,35.27 v13.72,35.27 20.54,35.27 22.1,36.83 25.02,36.83 v26.67,38.48
AGND  (via drill 0.35)
  Top 0.152: C3.2 v41.15,55.63 | C4.2 v49.02,55.63 | C5.2 v56.9,55.63 | C6.2 v64.77,55.63 | C7.2 v72.64,55.63 | R42.1 v79.5,45.21 | C51.2 v76.96,45.21 | R41.1 v74.17,45.21 | C50.2 v71.63,45.21 | R40.1 v68.83,45.21 | C49.2 v66.29,45.21 | R39.1 v63.5,45.21 | C48.2 v60.96,45.21 | R16.1 v58.17,45.21 | C47.2 v55.63,45.21 | DEMUX1.15 41.7,50.55 v40.13,50.55 | DEMUX1.12 49.23,51.82 v50.8,51.82 | C26.2 v39.12,47.75 | C18.2 v36.83,47.75 | C85.2 v11.43,44.45 | MCU.58 19.32,36.58 v19.3,36.58 | MCU.61 v17.82,36.58 | C23.2 v9.14,44.45 | C22.2 v11.43,49.78 | C24.2 v9.14,49.78
  Bottom 0.406: 78.74,39.62 ANALOG_BR.P$2 | ANALOG_BR.P$2 79.88,38.73 80.01,38.86 | ANALOG_BR.P$2 77.6,38.73 77.47,38.61
  pour Bottom (isolate 0.254): 19.81,35.81 7.62,35.81 7.62,60.96 81.28,60.96 81.28,38.1 76.2,38.1 76.2,44.7 35.56,44.7 35.56,53.34 12.7,53.34 12.7,37.08 19.81,37.08
AVCC  (via drill 0.35)
  Top 0.152: C7.1 69.61,58.15 TEMP_THUMB.1 | C6.1 61.74,58.15 TEMP_INDEX.1 | C5.1 53.86,58.15 TEMP_MIDDLE.1 | C4.1 45.99,58.15 TEMP_RING.1 | C3.1 38.12,58.15 TEMP_PINKY.1 | FSR_PINKY.+ C47.1 | FSR_RING.+ C48.1 | FSR_MIDDLE.+ C49.1 | FSR_INDEX.+ C50.1 | FSR_THUMB.+ C51.1 | DEMUX1.24 39.15,44.69 C26.1 C18.1
  Top 0.254: TEMP_THUMB.1 67.31,60.45 59.44,60.45 | 51.56,60.45 59.44,60.45 | 43.69,60.45 51.56,60.45 | 35.81,60.45 43.69,60.45 | 34.54,60.45 35.81,60.45 | 34.54,60.45 8.38,60.45 7.62,59.69 7.62,46.99 | TEMP_INDEX.1 59.44,60.45 | TEMP_MIDDLE.1 51.56,60.45 | TEMP_RING.1 43.69,60.45 | TEMP_PINKY.1 35.81,60.45 | v34.54,47.5 34.54,48.01 36.58,50.04 36.58,58.42 34.54,60.45 | v34.54,44.96 34.78,44.72 C18.1 | v45.72,43.94 44.98,44.69 DEMUX1.24 | v47.02,42.64 48.61,44.23 50.08,44.23 50.3,44.45 53.47,44.45 | C51.1 75.56,46.85 75.56,42.8 73.91,41.15 72.39,41.15 69.09,44.45 | 64.13,44.45 69.09,44.45 | 58.8,44.45 64.13,44.45 | 53.47,44.45 58.8,44.45 | C50.1 70.23,46.85 70.23,45.34 69.34,44.45 69.09,44.45 | C49.1 64.9,46.85 64.9,45.21 64.13,44.45 | C48.1 59.56,46.85 59.56,45.21 58.8,44.45 | C47.1 54.23,46.85 54.23,45.21 53.47,44.45 | MCU.62 17.32,38.95 16.89,39.37 12.7,39.37 11.43,40.64 C85.1 C23.1 9.13,41.4 8.13,41.4 7.62,41.91 7.62,46.99 | MCU.59 18.82,39.35 17.78,40.39 16,40.39 15.24,41.15 15.24,44.45 13.72,45.97 L1.2 C22.1 C24.1 7.86,46.75 7.62,46.99
  Bottom 0.254: v34.54,47.5 v34.54,44.96 | v45.72,43.94 v47.02,42.64
BATT_+
  Top 0.61: 67.56,18.38 J1.PWR
  Top 0.813: SW1.2 76.2,35.31 76.2,32.84 BATT1.+ 67.56,24.21 67.56,18.38
BATT_-
  Top 0.813: BATT1.- 70.48,23.92 J1.GND@2
FSR_INDEX
  Top 0.152: R39.2 FSR_RING.- 61.52,52.53 54.63,52.53 50.04,47.94 DEMUX1.6
FSR_MIDDLE
  Top 0.152: R40.2 FSR_MIDDLE.- 66.55,52.83 54.28,52.83 50.04,48.59 DEMUX1.7
FSR_PINKY
  Top 0.152: R42.2 FSR_THUMB.- 76.61,53.44 53.59,53.44 50.04,49.88 DEMUX1.9
FSR_RING
  Top 0.152: R41.2 FSR_INDEX.- 71.58,53.14 53.94,53.14 50.04,49.23 DEMUX1.8
FSR_THUMB
  Top 0.152: R16.2 FSR_PINKY.- 56.49,52.22 54.98,52.22 50.04,47.28 DEMUX1.5
GND  (via drill 0.35)
  Top 0.152: C81.2 v68.07,36.83 | C82.2 v65.79,36.83 | C80.K v60.96,42.42 | R1.1 v56.13,41.4 | C95.2 v50.8,40.64 | C96.2 v48.51,40.64 | C59.2 v24.13,46.23 | C60.2 v16,46.23 | C62.2 v9.4,26.92 | C61.2 v11.68,26.92 | C21.2 v12.95,21.59 | C58.2 v15.24,21.59 | C52.2 v17.53,21.59 | PWM_DRIVER.1 v19.14,1.78 | PWM_DRIVER.2 v19.79,1.02 | PWM_DRIVER.3 v20.44,1.78 | PWM_DRIVER.4 v21.09,1.02 | PWM_DRIVER.5 v21.74,1.78 | PWM_DRIVER.14 v28.96,3.25 | R12.1 v70.87,4.32 | R14.1 v63.25,4.32 | R4.1 v55.37,4.32 | R6.1 v47.5,4.32 | R8.1 v39.62,4.32 | R10.1 v31.75,4.32 | C25.2 v14.73,12.7 | C19.2 v17.02,12.7 | C63.2 v25.91,44.45 | C53.2 v31.75,30.73 | C55.2 v31.75,34.8 | C54.2 v31.75,28.45 | C57.2 v13.72,44.45 | C93.2 v37.85,40.64 | C92.2 v35.56,40.64 | PWM_DRIVER.25 v21.09,10.67 | PWM_DRIVER.23 v22.39,10.67 | v21.74,11.43 PWM_DRIVER.24 | S7.1 v8.94,3.56 | VREG3.1 v47.5,34.42 | VREG3.2 v47.5,35.69 | MCU.24 | R3.1 v27.18,11.68 | R2.1 v27.18,18.54 | 17.82,30.7 17.78,30.73 | 17.77,32.27 17.78,32.26 | 17.53,31.75 17.51,31.77 | 22.57,35.27 22.35,35.05
  Top 0.254: B1.5 11.43,34.29 11.68,34.54 12.95,34.54 13.73,33.77 MCU.7 17.54,33.77 | MCU.24 19.81,30.48 | 19.81,30.48 19.81,30.73 | MCU.20 17.82,30.48 | 17.82,30.48 17.82,30.7 | L2.1 v78.74,31.5 | MCU.10 17.77,32.27 17.77,32.02 v18.41,31.37 | MCU.11 17.51,31.77 17.91,31.37 v18.41,31.37 | MCU.45 22.57,35.27 | MCU.35 22.82,30.27 22.48,30.61 | 22.48,30.61 22.35,30.73 | MCU.33 23.05,29.27 21.72,30.61 v21.72,31.37 22.48,30.61 | 17.54,33.77 17.78,33.53 | MCU.55 20.82,35.57 | 20.82,35.57 20.83,35.56 | 20.82,35.57 20.82,35.45 v21.72,34.54 | 17.54,33.77 17.64,33.77 v18.41,34.54 | 17.82,30.48 18.41,31.08 18.41,31.24 | 18.41,31.24 v18.41,31.37 | 19.81,30.48 19.05,31.24 18.41,31.24
  Bottom 0.406: NOISE_BR.P$2 80.14,15.88 80.26,16 | NOISE_BR.P$2 77.34,15.88 77.22,16 | NOISE_BR.P$2 78.74,17.02
  other vias: 20.07,33.02
  pour Bottom (isolate 0.254, rank 6): 7.62,60.96 81.28,60.96 81.28,0 7.62,0
  pour Top (isolate 0.254): 17.57,35.53 22.57,35.53 22.57,30.53 17.57,30.53
MISO  (via drill 0.35)
  Top 0.152: MCU.39 24.96,32.26 26.67,32.26 27.53,31.39 27.53,24.89 26.92,24.28 v26.92,23.62
  Bottom 0.152: v26.92,23.62 26.92,21.67 24.97,19.71 18.69,19.71 AVR_ISP.1
MOSI  (via drill 0.35)
  Top 0.152: MCU.38 24.97,31.75 26.67,31.75 27.23,31.19 27.23,25.02 26.16,23.95 v26.16,22.61
  Bottom 0.152: v26.16,22.61 26.16,21.34 24.84,20.02 16.89,20.02 15.49,18.62 15.49,16.51 AVR_ISP.4
N$1
  Top 0.152: SERVO_WRIST.1 R11.1
N$2
  Top 0.152: L3.K R1.2
N$3
  Top 0.152: R3.2 24.15,13.66 L4.K
N$4
  Top 0.152: SERVO_THUMB.1 R9.1
N$5
  Top 0.152: R2.2 24.15,16.56 L5.K
N$6
  Top 0.152: SERVO_INDEX.1 R7.1
N$7
  Top 0.152: SERVO_MIDDLE.1 R5.1
N$8
  Top 0.152: SERVO_RING.1 R15.1
N$9
  Top 0.152: SERVO_PINKY.1 R13.1
N$10
  Top 0.152: C21.1 12.95,25.4 14.22,26.67 18.03,26.67 | MCU.21 18.32,26.95 18.03,26.67 | MCU.22 18.8,28.12 18.8,26.92 18.54,26.67 18.03,26.67
N$11
  Top 0.152: C57.1 15.41,39.73 17.42,39.73 18.32,38.83 MCU.60
N$30
  Top 0.152: MCU.57 19.81,41.78 | C60.1 19.81,45.45 19.81,41.78 | Y1.3 19.81,41.78
N$32
  Top 0.254: MCU.9 13.21,32.77 12.66,32.22 B1.3
N$33
  Top 0.254: MCU.8 13.21,33.27 12.66,33.82 B1.4
N$34
  Top 0.254: B1.2 11.43,30.99 11.68,30.73 C61.1
N$35
  Top 0.152: 20.32,44.07 MCU.56 | 20.32,44.07 20.32,45.45 C59.1 | Y1.1 20.32,44.08 20.32,44.07
N$38  (via drill 0.35)
  Top 0.254: v78.74,36.32 L2.2
  Bottom 0.254: ANALOG_BR.P$1 v78.74,36.32
N$39
  Top 0.254: C62.1 10.78,31.59 B1.1
  Top 0.305: B1.1 9.98,33.02 A6.FEED
N$41
  Top 0.152: C79.1 JP1.DTR
NGND  (via drill 0.35)
  Top 0.152: C98.2 v45.47,28.45 | C97.2 v45.47,30.73
  Top 0.254: C83.2 v42.16,18.03 | v44.45,18.03 C94.2 | C11.- v45.47,12.7 | C13.- v53.34,12.7 | C15.- v61.21,12.7 | C17.- v69.09,12.7 | C16.2 v67.56,10.41 | C1.2 v75.44,10.41 | C2.- v76.96,12.7 | C14.2 v59.69,10.41 | C12.2 v51.82,10.41 | C10.2 v43.94,10.41 | C8.2 v36.07,10.41 | C9.- v37.59,12.7 | C20.K v30.99,21.08 | v44.96,22.86 VREG1.3 v52.83,22.86
  Bottom 0.406: 78.74,13.72 NOISE_BR.P$1 | NOISE_BR.P$1 80.14,14.61 80.26,14.73 | NOISE_BR.P$1 77.34,14.61 77.22,14.48
  other vias: 53.59,16 54.86,16 56.13,16 57.4,16 58.67,16 59.94,16 61.21,16 62.48,16 63.75,16 65.28,16 65.28,17.53 65.28,18.8 65.28,20.07 65.28,21.34 65.28,22.86 65.28,24.38 65.28,25.65 65.28,26.92 65.28,28.19 65.28,29.72 63.75,29.72 62.48,29.72 61.21,29.72 59.94,29.72 58.67,29.72 57.4,29.72 56.13,29.72 54.86,29.72 53.59,29.72 52.83,20.83 52.83,19.05 52.83,17.27 52.83,24.89 52.83,26.67 52.83,28.45
  pour Bottom (isolate 0.254): 29.21,5.33 81.28,5.33 81.28,15.24 66.04,15.24 66.04,32 40.89,32 29.21,20.32
  pour Top (isolate 0.254): 66.04,15.24 52.07,15.24 52.07,30.48 66.04,30.48
PB6
  Top 0.152: MCU.42 27.19,33.77 27.43,33.53 30.48,33.53 32.51,31.5 32.51,25.83 28.14,21.46 28.14,16.71 27.69,16.26 L5.A
PB7
  Top 0.152: MCU.43 27.12,34.27 27.56,33.83 30.61,33.83 32.82,31.62 32.82,25.7 28.45,21.34 28.45,14.48 27.94,13.97 L4.A
PE2
  Top 0.152: DEMUX1.10 48.25,50.53 47.8,50.09 47.8,44.68 46.1,42.98 32.39,42.98 28.47,39.06 25.6,39.06 24.95,38.41 MCU.48
PE6
  Top 0.152: MCU.52 22.32,38.83 22.86,39.37 28.35,39.37 32.26,43.28 45.98,43.28 47.5,44.8 47.5,50.55 48.14,51.19 DEMUX1.11
PE7
  Top 0.152: DEMUX1.14 39.76,51.19 37.08,48.51 36.32,48.51 35.56,47.75 35.56,47.01 28.22,39.67 22.73,39.67 21.82,38.76 MCU.53
RESET  (via drill 0.35)
  Top 0.152: MCU.12 14.25,31.27 13.72,30.73 13.72,27.43 11.68,25.4 AVR_ISP.5 | AVR_ISP.5 10.41,16.51 10.41,9.91 10.68,9.64 | 10.68,9.64 R43.1 | 10.68,9.64 10.68,7.33 D1.A 10.9,1.5 10.34,0.94 S7.3 | AVR_ISP.5 12.95,16.51 18.03,16.51 v18.8,15.75 | v27.51,22.86 27.51,24.43 27.84,24.77 27.84,32.41 v28.19,32.77 | v29.72,42.67 28.96,43.43 C79.2
  Bottom 0.152: v18.8,15.75 22.45,19.41 25.09,19.41 27.51,21.82 v27.51,22.86 | v28.19,32.77 27.74,33.22 27.74,35.55 30.84,38.65 30.84,41.55 v29.72,42.67
RX0  (via drill 0.35)
  Top 0.152: JP1.TXO 25.15,52.58 26.92,52.58 27.69,51.82 27.69,42.16 v28.45,41.4 | v29.46,38.1 27.13,35.77 MCU.46
  Bottom 0.152: v28.45,41.4 29.46,40.39 v29.46,38.1
SCK  (via drill 0.35)
  Top 0.152: MCU.37 26.64,31.27 26.92,30.99 26.92,25.15 25.4,23.62 v25.4,21.59
  Bottom 0.152: v25.4,21.59 24.13,20.32 16.76,20.32 AVR_ISP.3
SCL
  Top 0.152: PWM_DRIVER.26 20.44,11.31 19.81,11.94 19.81,22.86 | 19.81,23.35 19.81,22.86 | 19.81,22.86 19.81,23.61 R17.1 20.32,24.66 MCU.25
SDA  (via drill 0.35)
  Top 0.152: PWM_DRIVER.27 19.79,11.14 v19.78,11.15 | v20.6,11.97 20.12,12.45 20.12,21.62 R18.1 21.59,23.1 21.59,25.15 20.82,25.92 MCU.26
  Bottom 0.152: v19.78,11.15 v20.6,11.97
SERVO_INDEX  (via drill 0.35)
  Top 0.152: R7.2 R6.2 47.77,2.3 v47.75,2.29 | PWM_DRIVER.9 24.34,1.64 v24.38,1.6
  Bottom 0.152: v47.75,2.29 46.48,1.02 24.96,1.02 v24.38,1.6
SERVO_MIDDLE
  Top 0.152: R5.2 R4.2 55.61,1.02 24.13,1.02 23.7,1.45 23.7,1.77 23.69,1.77 PWM_DRIVER.8
SERVO_PINKY
  Top 0.152: R13.2 R12.2 70.61,0.51 22.86,0.51 22.39,0.98 PWM_DRIVER.6
SERVO_RING  (via drill 0.35)
  Top 0.152: R15.2 R14.2 63.26,2.3 v63.25,2.29 | PWM_DRIVER.7 23.04,1.34 v23.11,1.27
  Bottom 0.152: v63.25,2.29 61.47,0.51 23.88,0.51 v23.11,1.27
SERVO_THUMB
  Top 0.152: R9.2 R8.2 40.37,1.52 25.4,1.52 24.99,1.93 PWM_DRIVER.10
SERVO_WRIST
  Top 0.152: PWM_DRIVER.11 25.64,2.3 25.91,2.03 32.77,2.03 33.04,2.3 R10.2 R11.2
SSN  (via drill 0.35)
  Top 0.152: DEMUX1.13 39.97,51.84 36.96,48.82 36.2,48.82 35.26,47.88 35.26,47.14 28.5,40.38 v27.43,40.38 | MCU.36 26.26,30.77 v26.34,30.69
  Bottom 0.152: v27.43,40.38 27.43,31.78 v26.34,30.69
TEMP_INDEX
  Top 0.152: TEMP_RING.2 49.78,56.9 49.78,55.12 49.02,54.36 44.7,54.36 43.48,53.14 43.48,50.23 42.49,49.23 DEMUX1.17 42.38,49.23
TEMP_MIDDLE
  Top 0.152: TEMP_MIDDLE.2 57.66,56.9 57.66,55.12 56.9,54.36 49.45,54.36 49.15,54.05 44.83,54.05 43.79,53.01 43.79,49.89 42.49,48.59 DEMUX1.18
TEMP_PINKY
  Top 0.152: TEMP_THUMB.2 73.41,56.9 73.41,55.12 72.64,54.36 65.2,54.36 64.9,54.05 57.45,54.05 57.15,53.75 49.71,53.75 49.4,53.44 45.08,53.44 44.4,52.76 44.4,49.2 42.49,47.28 DEMUX1.20
TEMP_RING
  Top 0.152: TEMP_INDEX.2 65.53,56.9 65.53,55.12 64.77,54.36 57.33,54.36 57.02,54.05 49.58,54.05 49.27,53.75 44.96,53.75 44.09,52.88 44.09,49.54 42.49,47.94 DEMUX1.19 42.09,47.94
TEMP_THUMB
  Top 0.152: TEMP_PINKY.2 41.91,56.9 41.91,54.36 43.18,53.09 43.18,50.58 42.49,49.88 DEMUX1.16
TX0  (via drill 0.35)
  Top 0.152: JP1.RXI 27.38,50.34 v27.38,41.45 | MCU.47 26.62,36.27 v28.45,38.1
  Bottom 0.152: v28.45,38.1 28.45,40.39 v27.38,41.45
VBATT
  Top 0.152: L3.A 55.3,33.85 | VREG1.1 48.61,26.16 48.5,26.27
  Top 0.254: 73.01,33.8 SW1.1 | 61.85,33.8 C80.A 60.12,33.85
  Top 0.406: 55.3,33.85 51.55,37.61 C95.1 C96.1 47.51,37.61 | D6.K 45.88,39.74 VREG3.4 46.9,38.23 47.51,37.61 | VREG3.3 46.86,36.96 47.51,37.61
  Top 0.61: 48.61,26.16 VREG1.2 | 55.44,33.85 54.61,33.02 50.78,33.02 C97.1 C98.1 48.5,26.27 42.59,26.27 D7.K
  Top 0.813: 73.01,33.8 C81.1 C82.1 61.85,33.8 | 60.12,33.85 L3.A 55.44,33.85
VCC  (via drill 0.35)
  Top 0.152: VREG3.5 40.48,38.19 | 38.85,37.61 38.86,37.59
  Top 0.254: PWM_DRIVER.28 17.05,9.45 C19.1 C25.1 | C25.1 14.73,7.34 D1.K | C25.1 12.92,9.41 R43.2 12.68,12.43 13.97,13.72 15.24,13.72 AVR_ISP.2 | v19.05,17.02 19.05,23.62 18.05,24.62 C52.1 C58.1 15.24,25.4 15.75,25.91 18.8,25.91 19.32,26.43 MCU.23 | MCU.34 26.11,29.77 26.42,29.46 26.42,27.18 23.62,24.38 22.61,24.38 | 22.61,24.38 R17.2 | MCU.44 28.69,34.77 C55.1 28.72,35.54 28.7,35.56 30.75,37.61 31.75,37.61 | MCU.54 21.32,39.1 22.35,40.13 25.65,40.13 25.91,40.39 C63.1 25.13,41.42 24.64,41.91 v24.64,42.42 24.64,44.96 25.15,45.47 25.15,48.77 24.13,49.78 22.86,49.78 JP1.VCC 19.81,49.78 13.97,49.78 13.72,49.53 L1.1 | v20.83,18.8 22.59,20.56 | 22.59,20.56 R18.2 22.61,22.11 22.61,24.38 | 22.59,20.56 26.4,20.56 28.72,22.88 C54.1 C53.1 28.7,30.75 28.7,32 28.96,32.26 v30.73,32.26 | v32.51,33.02 35.56,36.07 C92.1 31.75,37.61 | 31.75,37.61 30.26,39.1 v30.26,39.59
  Top 0.406: C92.1 C93.1 38.85,37.61 | D6.A 40.48,39.74 VREG3.5 39.5,38.23 38.86,37.59 39.5,36.96 VREG3.6
  Bottom 0.254: AVR_ISP.2 17.27,15.24 v19.05,17.02 v20.83,18.8 | v32.51,33.02 31.75,32.26 v30.73,32.26 | v30.26,39.59 30.23,39.62 30.23,40.89 28.7,42.42 v24.64,42.42

### Text on the board
tPlace: Transmission of Touch VR / Robotic Arm Rev 2 | Designed by: MrSwirlyEyes
bPlace: Designed by: MrSwirlyEyes | Transmission of Touch VR / Robotic Arm Rev 1